# EAGLE design megacommand21 (EAGLE 7.3.0)

## Sheet 1 of 5
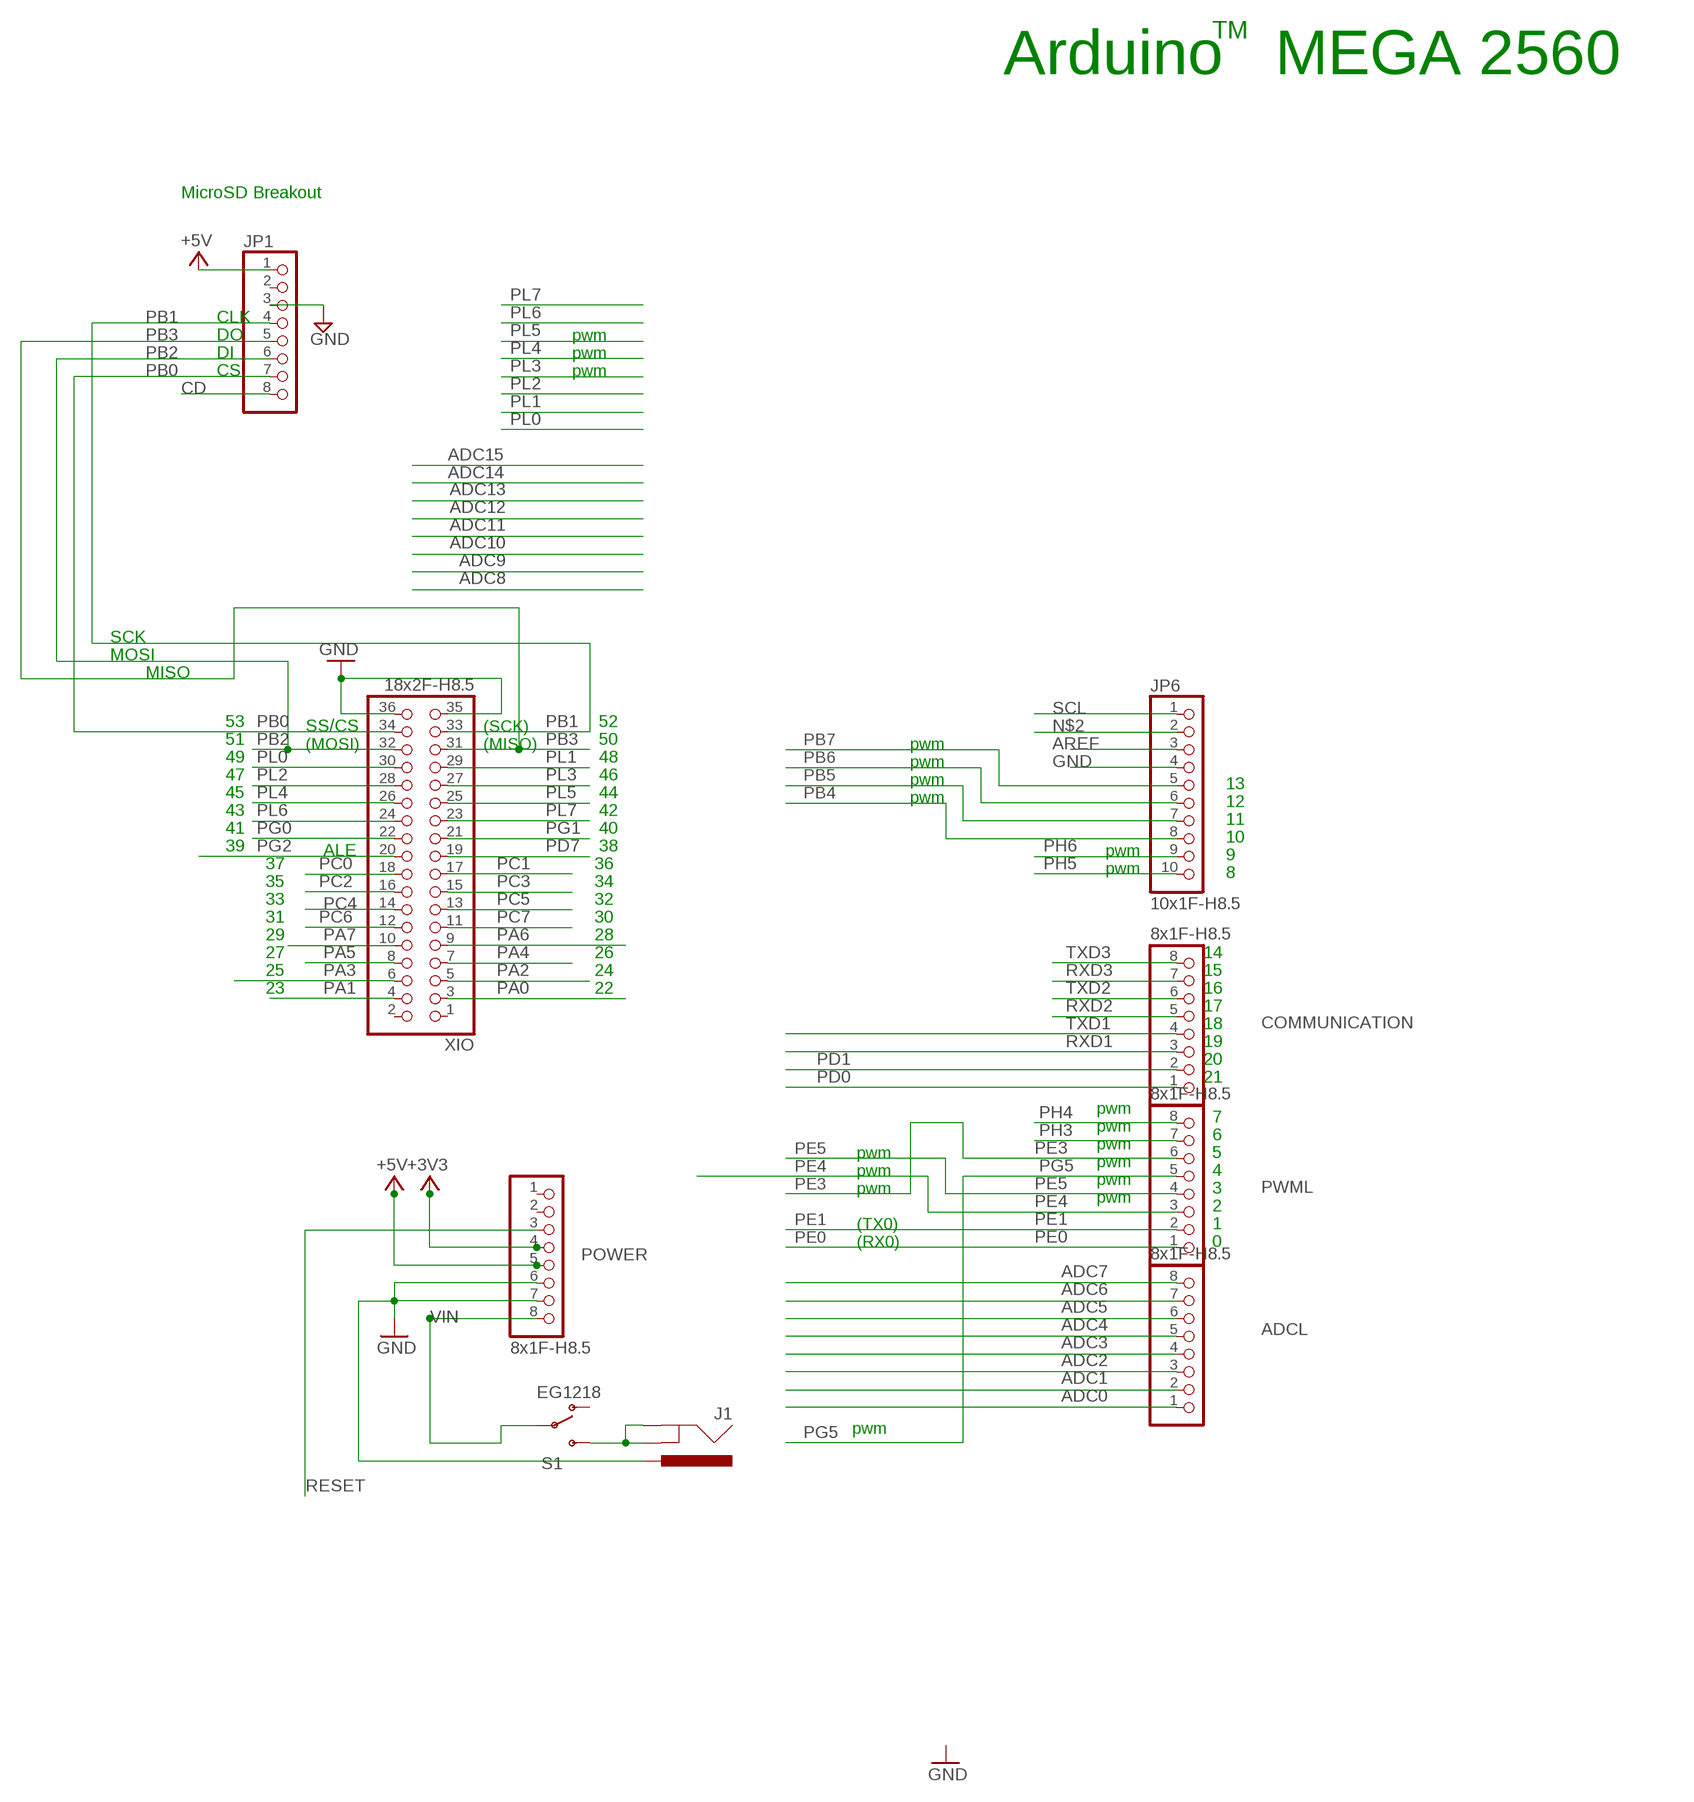
[diagram p0: schematic, sheet 1]

### Parts
ADCL  8x1F-H8.5  PINHD-1X8  [1X08]
COMMUNICATION  8x1F-H8.5  PINHD-1X8  [1X08]
J1  POWER_JACKSLT  [POWER_JACK_SLOT]
JP1  PINHD-1X8BIG  [1X08-BIG]
JP6  10x1F-H8.5  PINHD-1X10_ARD  [1X10]
POWER  8x1F-H8.5  PINHD-1X8  [1X08]
PWML  8x1F-H8.5  PINHD-1X8  [1X08]
S1  EG1218  SWITCH-SPDTKIT  [SWITCH-SPDT_KIT]
XIO  18x2F-H8.5  PINHD-2X18  [2X18]

### Nets
+3V3 [power]: POWER.4
+5V: JP1.1 POWER.5 ; also sheet 2,3,4,5
ADC0: ADCL.1 ; also sheet 3
ADC1: ADCL.2 ; also sheet 3
ADC2: ADCL.3 ; also sheet 3
ADC3: ADCL.4 ; also sheet 3
ADC4: ADCL.5
ADC5: ADCL.6
ADC6: ADCL.7
ADC7: ADCL.8
AREF: JP6.3
CD: JP1.8
GND: J1.PWR JP1.3 JP6.4 POWER.6 POWER.7 XIO.35 XIO.36 ; also sheet 2,3,4,5
N$2: JP6.2
N$23: J1.GND@1(GNDBREAK) J1.GND@2(GND) S1.3(S)
PA0: XIO.3 ; also sheet 4
PA1: XIO.4 ; also sheet 4
PA2: XIO.5 ; also sheet 4
PA3: XIO.6 ; also sheet 4
PA4: XIO.7 ; also sheet 4
PA5: XIO.8 ; also sheet 4
PA6: XIO.9 ; also sheet 4
PA7: XIO.10 ; also sheet 4
PB0: JP1.7 XIO.34
PB1: JP1.4 XIO.33
PB2: JP1.6 XIO.32
PB3: JP1.5 XIO.31
PB4: JP6.8
PB5: JP6.7
PB6: JP6.6
PB7: JP6.5
PC0: XIO.18 ; also sheet 4
PC1: XIO.17 ; also sheet 4
PC2: XIO.16 ; also sheet 4
PC3: XIO.15 ; also sheet 4
PC4: XIO.14 ; also sheet 4
PC5: XIO.13 ; also sheet 4
PC6: XIO.12 ; also sheet 4
PC7: XIO.11 ; also sheet 4
PD0: COMMUNICATION.1
PD1: COMMUNICATION.2
PD7: XIO.19
PE0: PWML.1
PE1: PWML.2
PE3: PWML.6
PE4: PWML.3 ; also sheet 3
PE5: PWML.4 ; also sheet 3
PG0: XIO.22 ; also sheet 4
PG1: XIO.21 ; also sheet 4
PG2: XIO.20 ; also sheet 4
PG5: PWML.5
PH3: PWML.7
PH4: PWML.8
PH5: JP6.10
PH6: JP6.9
PL0: XIO.30 ; also sheet 2
PL1: XIO.29 ; also sheet 2
PL2: XIO.28 ; also sheet 2
PL3: XIO.27 ; also sheet 3
PL4: XIO.26 ; also sheet 3
PL5: XIO.25
PL6: XIO.24 ; also sheet 4
PL7: XIO.23
RESET: POWER.3
RXD1: COMMUNICATION.3 ; also sheet 5
RXD2: COMMUNICATION.5 ; also sheet 5
RXD3: COMMUNICATION.7
SCL: JP6.1
TXD1: COMMUNICATION.4 ; also sheet 5
TXD2: COMMUNICATION.6 ; also sheet 5
TXD3: COMMUNICATION.8
VIN: POWER.8 S1.2(P)
Unconnected: JP1.2 POWER.1 POWER.2 S1.1(O) XIO.1 XIO.2

### Notes on the sheet
- TM
- Arduino   MEGA 2560
- MicroSD Breakout
- CLK
- DO | pwm
- DI | pwm
- CS | pwm
- SCK
- MOSI
- MISO
- 53 | SS/CS | (SCK) | 52
- 51 | (MOSI) | (MISO) | 50 | pwm
- 49 | 48 | pwm
- 47 | 46 | pwm
- 13
- 45 | 44 | pwm
- 12
- 43 | 42
- 11
- 41 | 40
- 10
- 39 | ALE | 38 | pwm
- 9
- 37 | 36 | pwm
- 8
- 35 | 34
- 33 | 32
- 31 | 30
- 29 | 28
- 27 | 26 | 14
- 25 | 24 | 15
- 23 | 22 | 16
- 17
- 18
- 19
- 20
- 21
- pwm
- 7
- pwm
- 6
- pwm
- pwm | 5
- pwm
- pwm | 4
- pwm
- pwm | 3
- pwm
- 2
- (TX0) | 1
- (RX0) | 0
- pwm

## Sheet 2 of 5
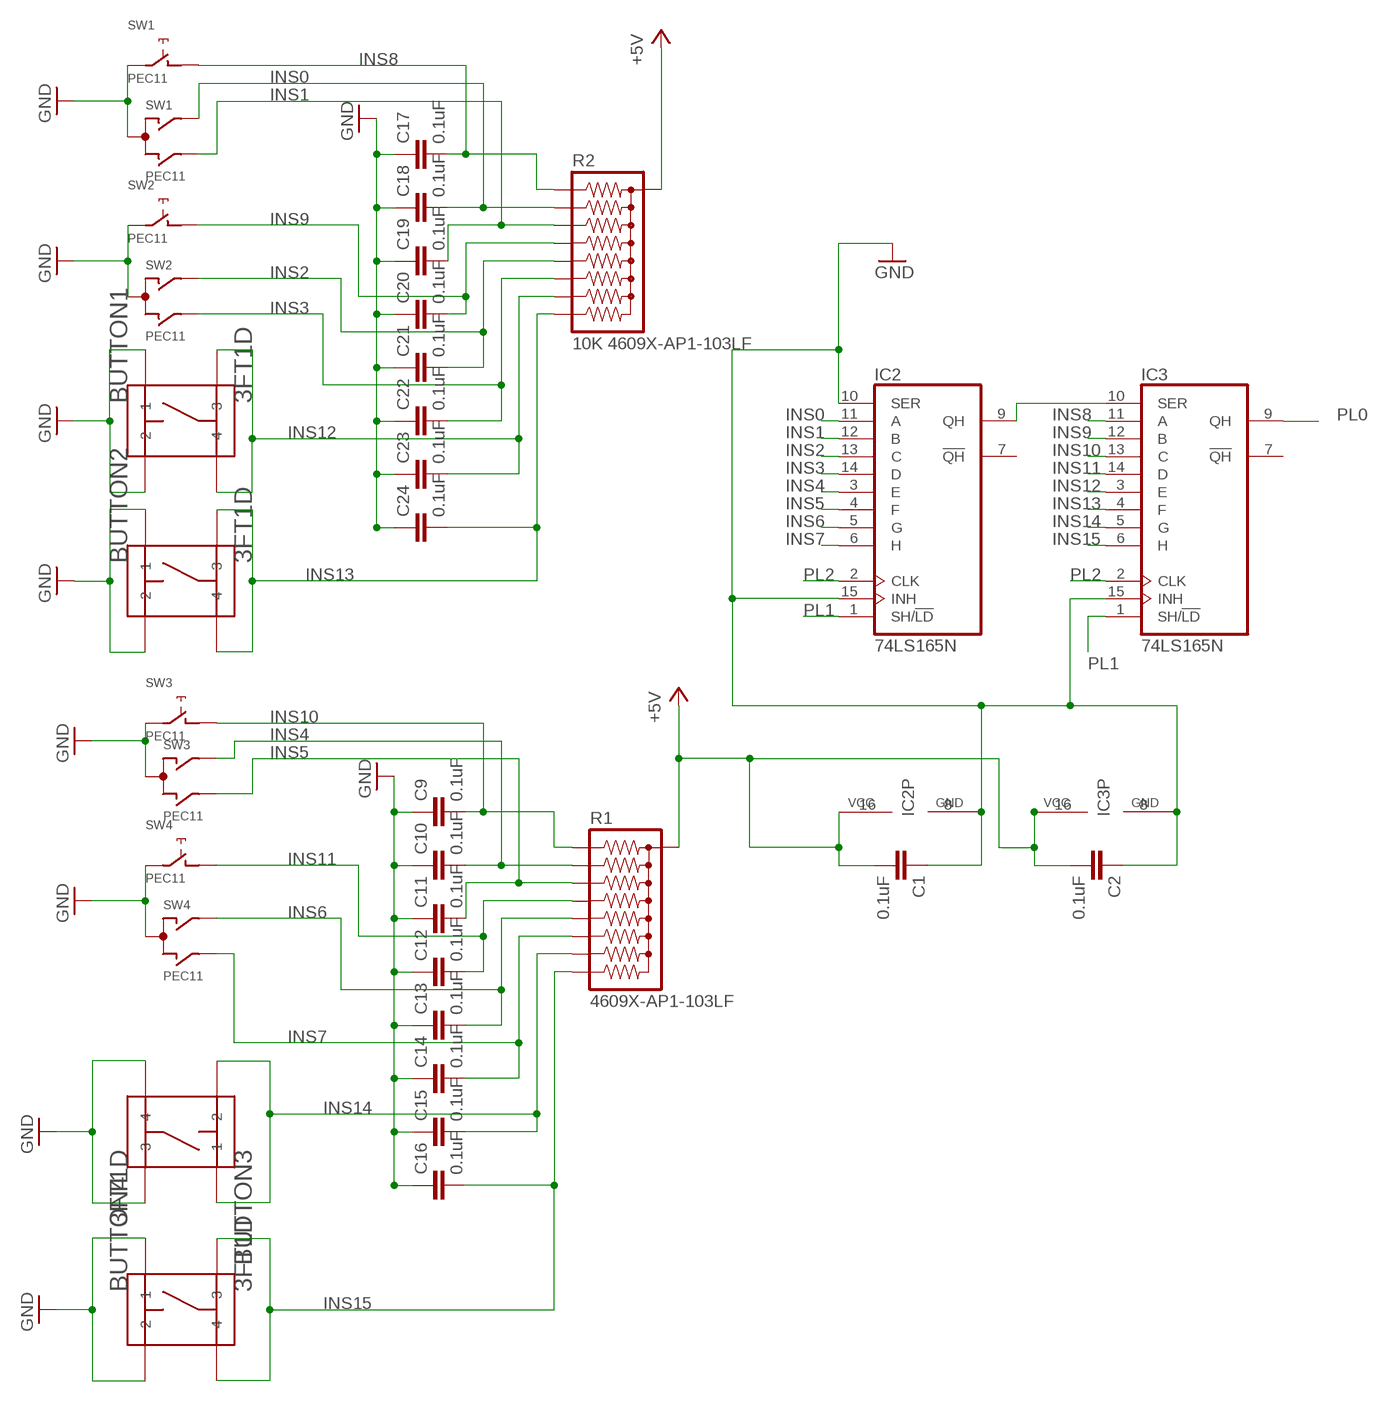
[diagram p1: schematic, sheet 2]

### Parts
BUTTON1  3FT1D  [3FT]
BUTTON2  3FT1D  [3FT]
BUTTON3  3FT1D  [3FT]
BUTTON4  3FT1D  [3FT]
C1  0.1uF  C-EU025-050X050  [C025-050X050]
C2  0.1uF  C-EU025-050X050  [C025-050X050]
C9  0.1uF  C-EU025-050X050  [C025-050X050]
C10  0.1uF  C-EU025-050X050  [C025-050X050]
C11  0.1uF  C-EU025-050X050  [C025-050X050]
C12  0.1uF  C-EU025-050X050  [C025-050X050]
C13  0.1uF  C-EU025-050X050  [C025-050X050]
C14  0.1uF  C-EU025-050X050  [C025-050X050]
C15  0.1uF  C-EU025-050X050  [C025-050X050]
C16  0.1uF  C-EU025-050X050  [C025-050X050]
C17  0.1uF  C-EU025-050X050  [C025-050X050]
C18  0.1uF  C-EU025-050X050  [C025-050X050]
C19  0.1uF  C-EU025-050X050  [C025-050X050]
C20  0.1uF  C-EU025-050X050  [C025-050X050]
C21  0.1uF  C-EU025-050X050  [C025-050X050]
C22  0.1uF  C-EU025-050X050  [C025-050X050]
C23  0.1uF  C-EU025-050X050  [C025-050X050]
C24  0.1uF  C-EU025-050X050  [C025-050X050]
IC2  74LS165N  [DIL16]
IC3  74LS165N  [DIL16]
R1  4609X-AP1-103LF  RPACK-BUSSED-8-SIP-PTH-8  [RPACK-SIP-PTH-8]
R2  10K 4609X-AP1-103LF  RPACK-BUSSED-8-SIP-PTH-8  [RPACK-SIP-PTH-8]
SW1  PEC11  EC12E_SW  [ALPS_EC12E_SW]
SW2  PEC11  EC12E_SW  [ALPS_EC12E_SW]
SW3  PEC11  EC12E_SW  [ALPS_EC12E_SW]
SW4  PEC11  EC12E_SW  [ALPS_EC12E_SW]

### Nets
+5V: C1.2 C2.2 IC2.16(VCC) IC3.16(VCC) R1.P$1 R2.P$1 ; also sheet 1,3,4,5
GND: BUTTON1.P$1 BUTTON1.P$2 BUTTON2.P$1 BUTTON2.P$2 BUTTON3.P$3 BUTTON3.P$4 BUTTON4.P$1 BUTTON4.P$2 C1.1 C2.1 C9.1 C10.1 C11.1 C12.1 C13.1 C14.1 C15.1 C16.1 C17.1 C18.1 C19.1 C20.1 C21.1 C22.1 C23.1 C24.1 IC2.8(GND) IC2.10(SER) IC2.15(INH) IC3.8(GND) IC3.15(INH) SW1.C SW1.E SW2.C SW2.E SW3.C SW3.E SW4.C SW4.E ; also sheet 1,3,4,5
INS0: C18.2 IC2.11(A) R2.P$3 SW1.A
INS1: C19.2 IC2.12(B) R2.P$4 SW1.B
INS2: C21.2 IC2.13(C) R2.P$6 SW2.A
INS3: C22.2 IC2.14(D) R2.P$7 SW2.B
INS4: C10.2 IC2.3(E) R1.P$3 SW3.A
INS5: C11.2 IC2.4(F) R1.P$4 SW3.B
INS6: C13.2 IC2.5(G) R1.P$6 SW4.A
INS7: C14.2 IC2.6(H) R1.P$7 SW4.B
INS8: C17.2 IC3.11(A) R2.P$2 SW1.D
INS9: C20.2 IC3.12(B) R2.P$5 SW2.D
INS10: C9.2 IC3.13(C) R1.P$2 SW3.D
INS11: C12.2 IC3.14(D) R1.P$5 SW4.D
INS12: BUTTON1.P$3 BUTTON1.P$4 C23.2 IC3.3(E) R2.P$8
INS13: BUTTON2.P$3 BUTTON2.P$4 C24.2 IC3.4(F) R2.P$9
INS14: BUTTON3.P$1 BUTTON3.P$2 C15.2 IC3.5(G) R1.P$8
INS15: BUTTON4.P$3 BUTTON4.P$4 C16.2 IC3.6(H) R1.P$9
N$12: IC2.9(QH) IC3.10(SER)
PL0: IC3.9(QH) ; also sheet 1
PL1: IC2.1(SH/!LD) IC3.1(SH/!LD) ; also sheet 1
PL2: IC2.2(CLK) IC3.2(CLK) ; also sheet 1
Unconnected: IC2.7(!QH) IC3.7(!QH) SW1.GND1(GND1:G) SW1.GND2(GND2:G) SW2.GND1(GND1:G) SW2.GND2(GND2:G) SW3.GND1(GND1:G) SW3.GND2(GND2:G) SW4.GND1(GND1:G) SW4.GND2(GND2:G)

## Sheet 3 of 5
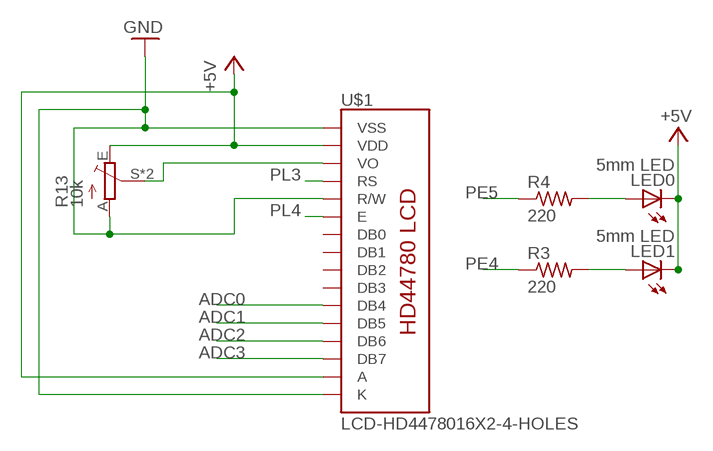
[diagram p2: schematic, sheet 3]

### Parts
LED0  5mm LED  LED_ELD260  [LED_LD260]
LED1  5mm LED  LED_ELD260  [LED_LD260]
R3  220  R-US_0207/7  [0207/7]
R4  220  R-US_0207/7  [0207/7]
R13  10k  TRIM_EU-CA6V  [CA6V]
U$1  LCD-HD4478016X2-4-HOLES  [LCD-16X2-4HOLESRGB]

### Nets
+5V: LED0.K(C) LED1.K(C) R13.E U$1.2(VDD) U$1.15(A) U$1.18(VDD) U$1.31(A) ; also sheet 1,2,4,5
ADC0: U$1.11(DB4) U$1.27(DB4) ; also sheet 1
ADC1: U$1.12(DB5) U$1.28(DB5) ; also sheet 1
ADC2: U$1.13(DB6) U$1.29(DB6) ; also sheet 1
ADC3: U$1.14(DB7) U$1.30(DB7) ; also sheet 1
GND: R13.A U$1.1(VSS) U$1.5(R/W) U$1.16(K) U$1.17(VSS) U$1.21(R/W) U$1.32(K) ; also sheet 1,2,4,5
N$3: LED0.A R4.2
N$13: LED1.A R3.2
N$27: R13.S R13.S1(S) U$1.3(VO) U$1.19(VO)
PE4: R3.1 ; also sheet 1
PE5: R4.1 ; also sheet 1
PL3: U$1.4(RS) U$1.20(RS) ; also sheet 1
PL4: U$1.6(E) U$1.22(E) ; also sheet 1
Unconnected: U$1.7(DB0) U$1.8(DB1) U$1.9(DB2) U$1.10(DB3) U$1.23(DB0) U$1.24(DB1) U$1.25(DB2) U$1.26(DB3)

## Sheet 4 of 5
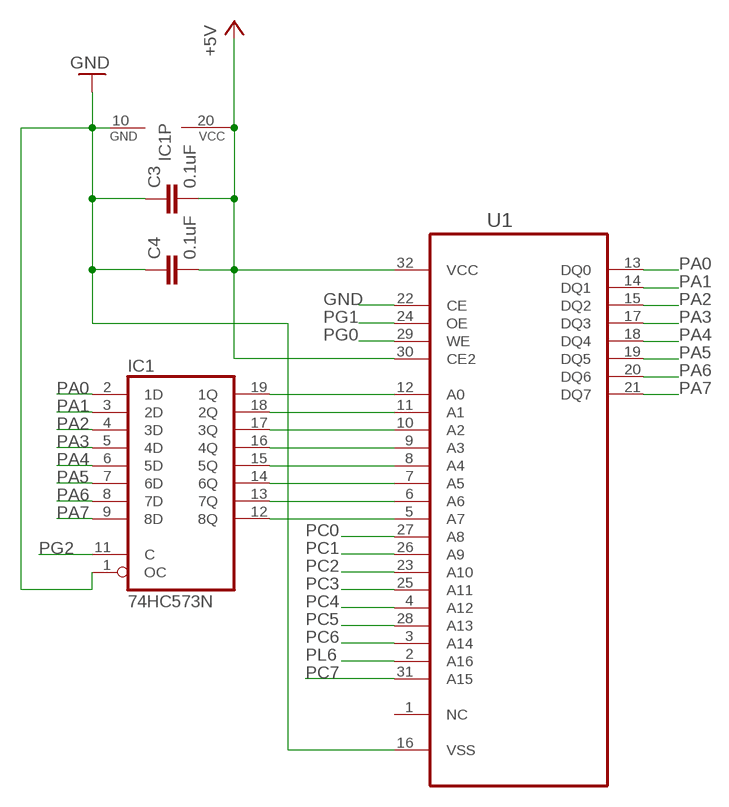
[diagram p3: schematic, sheet 4]

### Parts
C3  0.1uF  C-EU025-050X050  [C025-050X050]
C4  0.1uF  C-EU025-050X050  [C025-050X050]
IC1  74HC573N  [DIL20]
U1  AS6C1008-55PCN  [DIP254P1524X393-32]

### Nets
+5V: C3.2 C4.2 IC1.20(VCC) U1.30(CE2) U1.32(VCC) ; also sheet 1,2,3,5
GND: C3.1 C4.1 IC1.1(OC) IC1.10(GND) U1.16(VSS) U1.22(CE) ; also sheet 1,2,3,5
N$4: IC1.13(7Q) U1.6(A6)
N$5: IC1.19(1Q) U1.12(A0)
N$6: IC1.18(2Q) U1.11(A1)
N$7: IC1.17(3Q) U1.10(A2)
N$8: IC1.16(4Q) U1.9(A3)
N$9: IC1.15(5Q) U1.8(A4)
N$10: IC1.14(6Q) U1.7(A5)
N$11: IC1.12(8Q) U1.5(A7)
PA0: IC1.2(1D) U1.13(DQ0) ; also sheet 1
PA1: IC1.3(2D) U1.14(DQ1) ; also sheet 1
PA2: IC1.4(3D) U1.15(DQ2) ; also sheet 1
PA3: IC1.5(4D) U1.17(DQ3) ; also sheet 1
PA4: IC1.6(5D) U1.18(DQ4) ; also sheet 1
PA5: IC1.7(6D) U1.19(DQ5) ; also sheet 1
PA6: IC1.8(7D) U1.20(DQ6) ; also sheet 1
PA7: IC1.9(8D) U1.21(DQ7) ; also sheet 1
PC0: U1.27(A8) ; also sheet 1
PC1: U1.26(A9) ; also sheet 1
PC2: U1.23(A10) ; also sheet 1
PC3: U1.25(A11) ; also sheet 1
PC4: U1.4(A12) ; also sheet 1
PC5: U1.28(A13) ; also sheet 1
PC6: U1.3(A14) ; also sheet 1
PC7: U1.31(A15) ; also sheet 1
PG0: U1.29(WE) ; also sheet 1
PG1: U1.24(OE) ; also sheet 1
PG2: IC1.11(C) ; also sheet 1
PL6: U1.2(A16) ; also sheet 1
Unconnected: U1.1(NC)

## Sheet 5 of 5
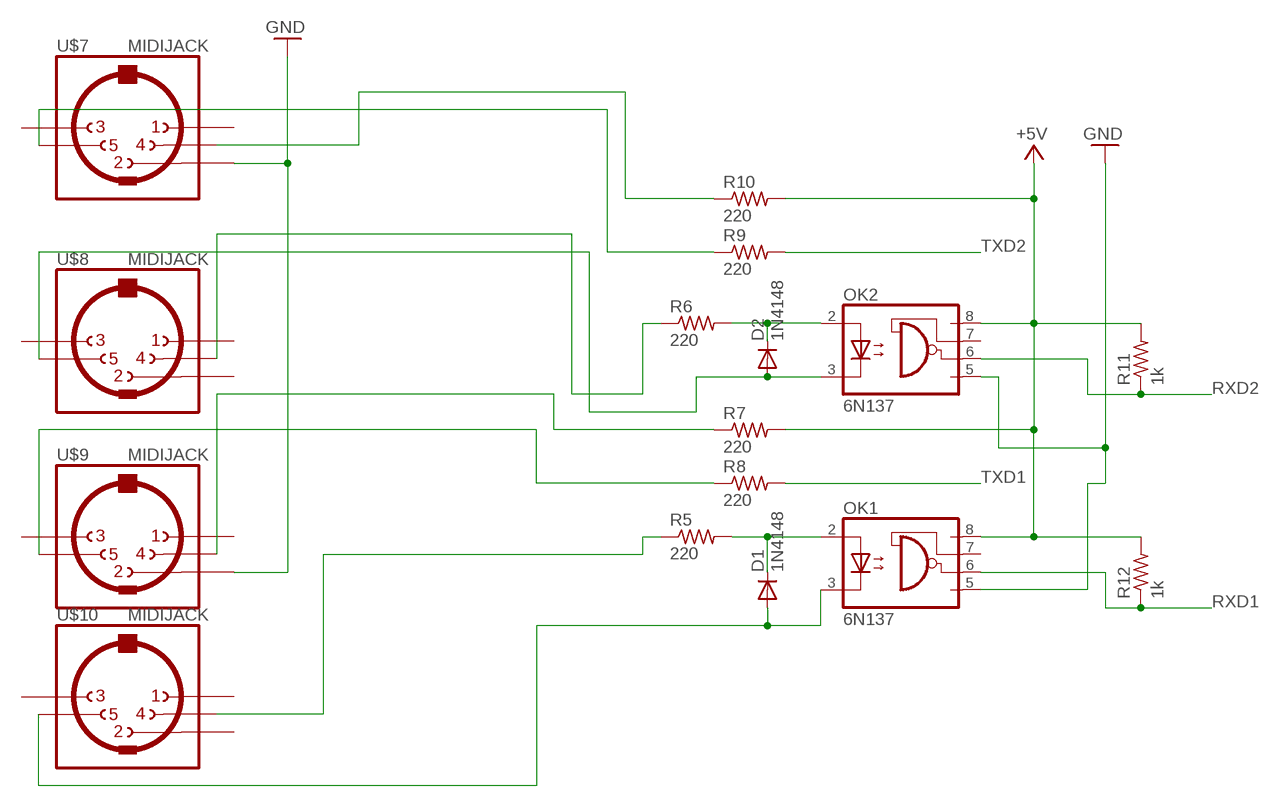
[diagram p4: schematic, sheet 5]

### Parts
D1  1N4148  1N4148DO35-7  [DO35-7]
D2  1N4148  1N4148DO35-7  [DO35-7]
OK1  6N137  [DIL08]
OK2  6N137  [DIL08]
R5  220  R-US_0207/7  [0207/7]
R6  220  R-US_0207/7  [0207/7]
R7  220  R-US_0207/7  [0207/7]
R8  220  R-US_0207/7  [0207/7]
R9  220  R-US_0207/7  [0207/7]
R10  220  R-US_0207/7  [0207/7]
R11  1k  R-US_0207/7  [0207/7]
R12  1k  R-US_0207/7  [0207/7]
U$7  MIDIJACK  [CP-2350]
U$8  MIDIJACK  [CP-2350]
U$9  MIDIJACK  [CP-2350]
U$10  MIDIJACK  [CP-2350]

### Nets
+5V: OK1.8(VCC) OK2.8(VCC) R7.2 R10.2 R11.2 R12.2 ; also sheet 1,2,3,4
GND: OK1.5(GND) OK2.5(GND) U$7.2 U$9.2 ; also sheet 1,2,3,4
N$1: R8.1 U$9.5
N$14: D1.A OK1.3(C) U$10.5
N$15: R5.1 U$10.4
N$16: R7.1 U$9.4
N$17: R10.1 U$7.4
N$18: D2.C OK2.2(A) R6.2
N$19: D2.A OK2.3(C) U$8.5
N$21: R6.1 U$8.4
N$22: R9.1 U$7.5
N$26: D1.C OK1.2(A) R5.2
RXD1: OK1.6(VO) R12.1 ; also sheet 1
RXD2: OK2.6(VO) R11.1 ; also sheet 1
TXD1: R8.2 ; also sheet 1
TXD2: R9.2 ; also sheet 1
Unconnected: OK1.7(VE) OK2.7(VE) U$7.1 U$7.3 U$8.1 U$8.2 U$8.3 U$9.1 U$9.3 U$10.1 U$10.2 U$10.3

## Library data of the parts
ADCL COMMUNICATION POWER PWML = SmartPrj:PINHD-1X8: PIN HEADER
BUTTON1-BUTTON4 = mec switches:3FT1D: Mulitmec - 3FT1D <http://www.mec.dk/statisk.php4?id=504> Switch 3F - Through Hole with basic matt cover http://www.mec.dk
C1-C4 C9-C24 = rcl:C-EU: CAPACITOR, European symbol
D1 D2 = diode:1N4148: DIODE high speed (Philips)
IC1 = 74xx-us:74*573: 8-bit D latch BUS DRIVER
IC2 IC3 = 74xx-us:74*165: 8-bit parallel load SHIFT REGISTER
J1 = SparkFun-Connectors:POWER_JACK: Power Jack This is the standard 5.5mm barrel jack for power. The PTH is the most common, proven, reliable, footprint. The Slot footprint only works if the mill layer is transmitted to the PCB fab house so be warned. Mating wall wart : TOL-00298 (and others); PROD_ID: PRT-00119
JP1 = adafruit:PINHD-1X8: PIN HEADER
JP6 = SmartPrj:PINHD-1X10_ARD: PIN HEADER
LED0 LED1 = eagle-ltspice:LED_E: LED Source: http://www.osram.convergy.de Source: www.luxeon.com Source: www.kingbright.com; SPICEMODEL: NONE; SPICEPREFIX: D; SPICETYPE: diode
OK1 OK2 = optocoupler:6N137: MOTOROLA OPTO COUPLER; MPN: 6N137; OC_FARNELL: 1328376; OC_NEWARK: 52M1895
R1 R2 = SparkFun-Resistors:RPACK-BUSSED-8: BOURNS 4600X/R series thick-film SIP resistor packs Height resistors bussed to a single pin (denoted by dot). datasheet <http://dlnmh9ip6v2uc.cloudfront.net/datasheets/Components/General/4600x.pdf> SIMILAR TO: SFE parts COM-10855 (330), COM-10856 (10K)
R3-R12 = resistor:R-US_: RESISTOR, American symbol
R13 = pot:TRIM_EU-: POTENTIOMETER
S1 = SparkFun-Electromechanical:SWITCH-SPDT: SPDT Switch Simple slide switch, Spark Fun Electronics SKU : COM-00102 DPDT SMT slide switch, AYZ0202, SWCH-08179; PROD_ID: SWCH-08261
SW1-SW4 = pec11-n:EC12E_SW: ALPS rotary Encoder EC12E series with switch; MPN: EC12E2424407; OC_FARNELL: 1520813; OC_NEWARK: 74M1068
U1 = Alliance_Memory_By_element14_Batch_1:AS6C1008-55PCN: CMOS SRAM; MPN: AS6C1008-55PCN; OC_FARNELL: 1562896; OC_NEWARK: 94M6214; PACKAGE: DIP-32; SUPPLIER: ALLIANCE MEMORY
U$1 = HD44780LCD:LCD-HD44780
U$7-U$10 = adafruit_din:MIDIJACK: DIN 5 jack also known as MIDI jack A modification of conn-hirshman:MAB5SH with two options for the grounding 'teeth'
XIO = SmartPrj:PINHD-2X18: PIN HEADER

## Net classes
0 default: width 0.203 mm, drill 0.406 mm, clearance 0.203 mm
1 power: width 0.61 mm, drill 0.406 mm, clearance 0.203 mm
2 gnd: width 0.305 mm, drill 0.406 mm, clearance 0.203 mm
3 power usb: width 0.508 mm, drill 0.406 mm, clearance 0.203 mm

## Board
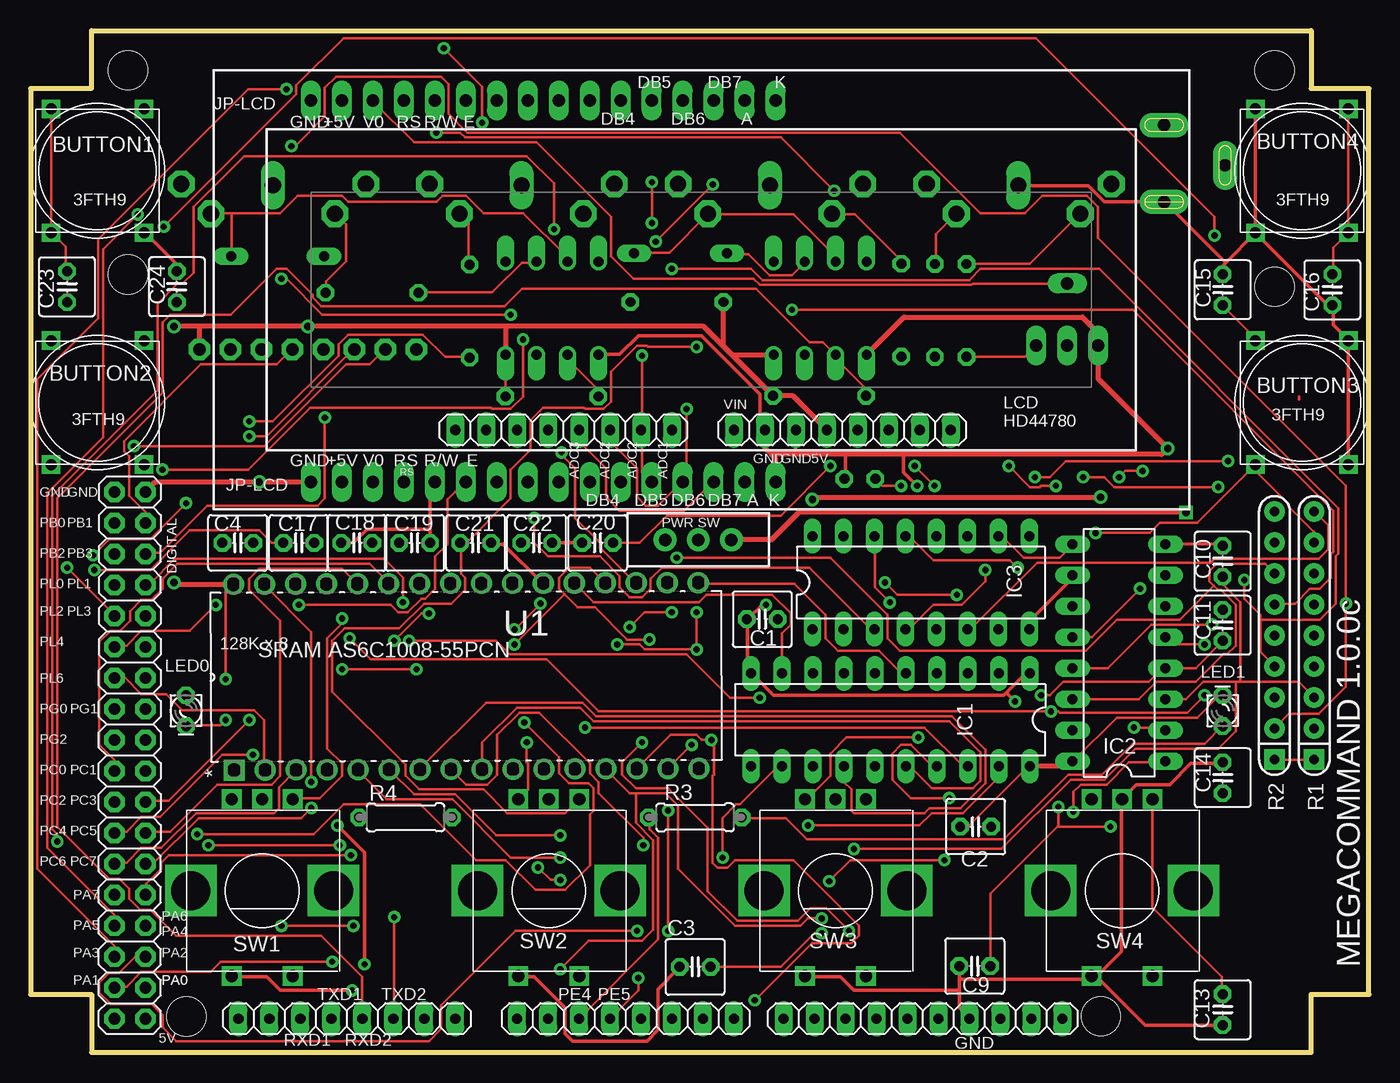
[diagram p5: board, top side]
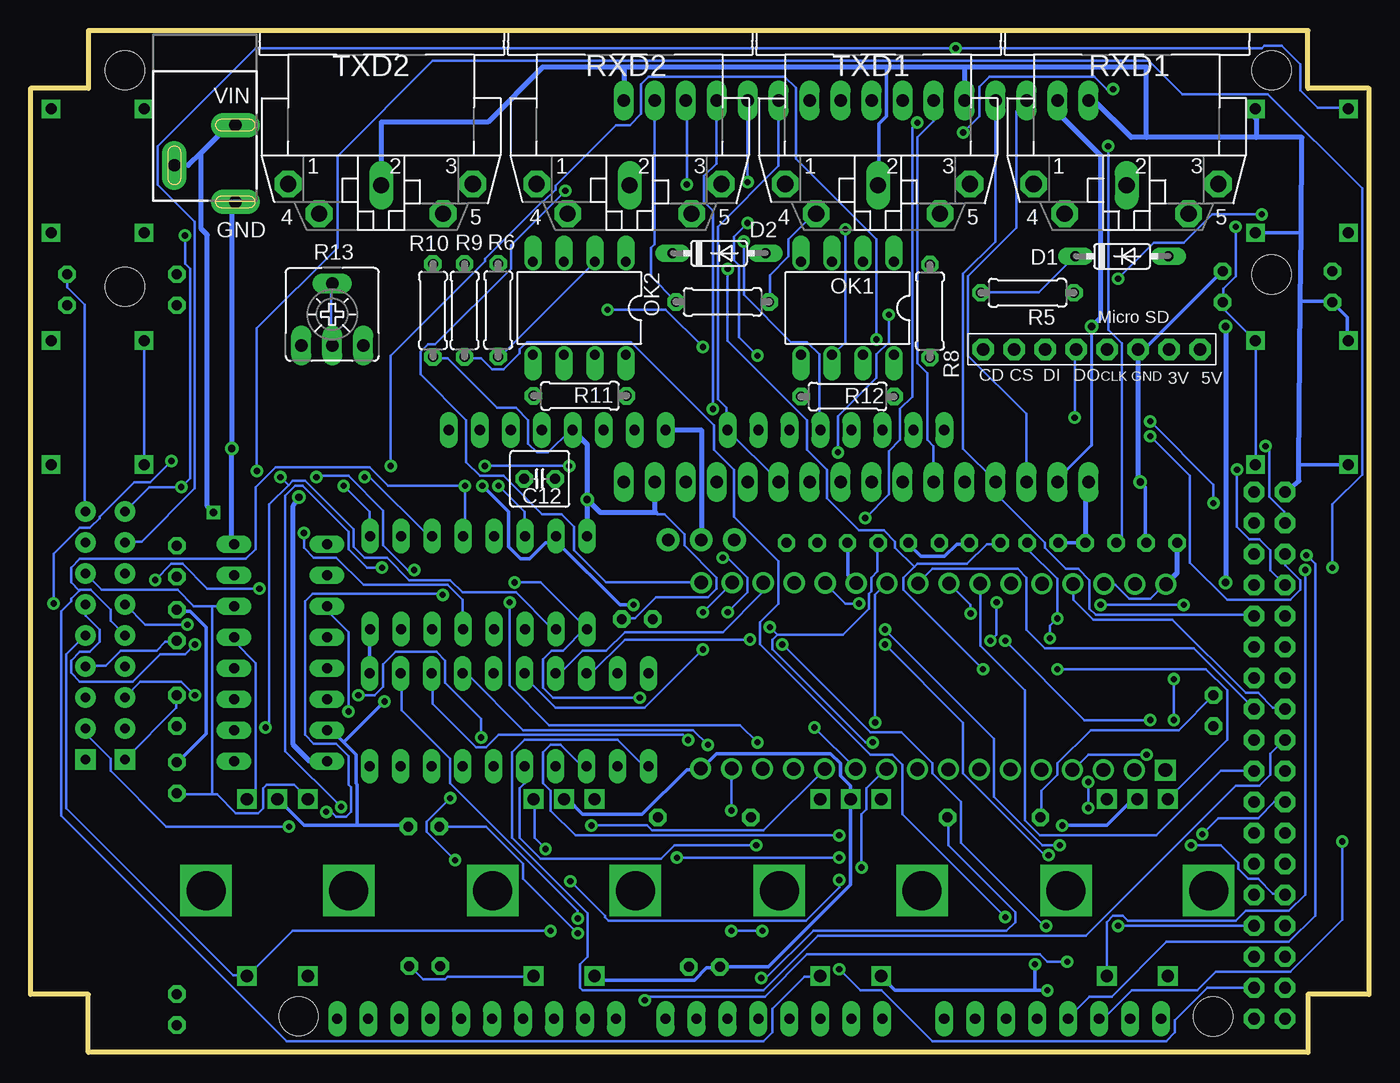
[diagram p6: board, bottom side, seen from below]

Size 109.75 x 83.75 mm. Coordinates in mm from the lower left corner, seen from the top.
Outline: 0,79 0,4.75 5,4.75 5,0 105,0 105,4.75 109.75,4.75 109.75,79 105,79 105,83.75 5,83.75 5,79 0,79
Copper layers (1*16): Top 0.035mm / dielectric 1.5mm / Bottom 0.035mm
Design rules "SparkFun": minimum track width 8mil, minimum drill 20mil, track to track 8mil, track to pad 8mil, pad to pad 8mil, via to via 8mil, smd to smd 8mil, copper to edge 10mil, drill to drill 8mil, minimum pad ring 12mil, minimum via ring 10mil, stop-mask expansion 4mil, vias tented up to drill 25mil, thermal gap 10mil
Holes 3.2 mm at 87.77,2.95 12.79,2.92 8,63.75 102,62.75 8,80.5 102,80.5

### Footprints (pad centres in the part's own frame; a part is rotated, then mirrored left to right if it is on the bottom)
1X08 = drill 0.85 pad 1.422 long: 1 -8.89,0; 2 -6.35,0; 3 -3.81,0; 4 -1.27,0; 5 1.27,0; 6 3.81,0; 7 6.35,0; 8 8.89,0
3FT = drill 0.9 square: P$1 5.08,3.81; P$2 -5.08,3.81; P$3 5.08,-3.81; P$4 -5.08,-3.81
C025-050X050 = drill 0.813 octagon: 1 -1.27,0; 2 1.27,0
DO35-7 = drill 0.813 long: A 3.81,0; C -3.81,0
DIL20 = drill 0.813 long: 1 -11.43,-3.81; 2 -8.89,-3.81; 3 -6.35,-3.81; 4 -3.81,-3.81; 5 -1.27,-3.81; 6 1.27,-3.81; 7 3.81,-3.81; 8 6.35,-3.81; 9 8.89,-3.81; 10 11.43,-3.81; 11 11.43,3.81; 12 8.89,3.81; 13 6.35,3.81; 14 3.81,3.81; 15 1.27,3.81; 16 -1.27,3.81; 17 -3.81,3.81; 18 -6.35,3.81; 19 -8.89,3.81; 20 -11.43,3.81
DIL16 = drill 0.813 long: 1 -8.89,-3.81; 2 -6.35,-3.81; 3 -3.81,-3.81; 4 -1.27,-3.81; 5 1.27,-3.81; 6 3.81,-3.81; 7 6.35,-3.81; 8 8.89,-3.81; 9 8.89,3.81; 10 6.35,3.81; 11 3.81,3.81; 12 1.27,3.81; 13 -1.27,3.81; 14 -3.81,3.81; 15 -6.35,3.81; 16 -8.89,3.81
POWER_JACK_SLOT = drill 1 pad 2 long: GND@1 2.58,7.5; GND@2 7.58,10.8; PWR 2.58,13.8
1X08-BIG = drill 1.016 pad 1.778 octagon: 1 -8.89,0; 2 -6.35,0; 3 -3.81,0; 4 -1.27,0; 5 1.27,0; 6 3.81,0; 7 6.35,0; 8 8.89,0
1X10 = drill 0.85 pad 1.422 long: 1 -11.43,0; 2 -8.89,0; 3 -6.35,0; 4 -3.81,0; 5 -1.27,0; 6 1.27,0; 7 3.81,0; 8 6.35,0; 9 8.89,0; 10 11.43,0
LED_LD260 = drill 0.813 octagon: A -1.27,0; K 1.27,0
DIL08 = drill 0.813 offset: 1 -3.81,-3.81; 2 -1.27,-3.81; 3 1.27,-3.81; 4 3.81,-3.81; 5 3.81,3.81; 6 1.27,3.81; 7 -1.27,3.81; 8 -3.81,3.81
RPACK-SIP-PTH-8 = drill 0.8 pad 1.676 square: P$1 0,0 | drill 0.8 pad 1.676: P$2 0,-2.54; P$3 0,-5.08; P$4 0,-7.62; P$5 0,-10.16; P$6 0,-12.7; P$7 0,-15.24; P$8 0,-17.78; P$9 0,-20.32
0207/7 = drill 0.813 octagon: 1 -3.81,0; 2 3.81,0
CA6V = drill 1.016 long: A -2.54,-2.54; E 2.54,-2.54; S 0,2.54; S1 0,-2.54
SWITCH-SPDT_KIT = drill 1.016 pad 1.88: 1 0,2.718; 2 0,0; 3 0,-2.718
ALPS_EC12E_SW = drill 1 square: A -2.5,-7.5; B 2.5,-7.5; C 0,-7.5; D -2.5,7; E 2.5,7 | drill 3.2 square: GND1 -5.85,0; GND2 5.85,0
DIP254P1524X393-32 = drill 1.118 square: 1 -15.24,38.1 | drill 1.118: 2 -15.24,35.56; 3 -15.24,33.02; 4 -15.24,30.48; 5 -15.24,27.94; 6 -15.24,25.4; 7 -15.24,22.86; 8 -15.24,20.32; 9 -15.24,17.78; 10 -15.24,15.24; 11 -15.24,12.7; 12 -15.24,10.16; 13 -15.24,7.62; 14 -15.24,5.08; 15 -15.24,2.54; 16 -15.24,0; 17 0,0; 18 0,2.54; 19 0,5.08; 20 0,7.62; 21 0,10.16; 22 0,12.7; 23 0,15.24; 24 0,17.78; 25 0,20.32; 26 0,22.86; 27 0,25.4; 28 0,27.94; 29 0,30.48; 30 0,33.02; 31 0,35.56; 32 0,38.1
LCD-16X2-4HOLESRGB = drill 1.016 long: 1 -32,15.5; 2 -29.46,15.5; 3 -26.92,15.5; 4 -24.38,15.5; 5 -21.84,15.5; 6 -19.3,15.5; 7 -16.76,15.5; 8 -14.22,15.5; 9 -11.68,15.5; 10 -9.14,15.5; 11 -6.6,15.5; 12 -4.06,15.5; 13 -1.52,15.5; 14 1.02,15.5; 15 3.56,15.5; 16 6.1,15.5; 17 -32,-15.75; 18 -29.46,-15.75; 19 -26.92,-15.75; 20 -24.38,-15.75; 21 -21.84,-15.75; 22 -19.3,-15.75; 23 -16.76,-15.75; 24 -14.22,-15.75; 25 -11.68,-15.75; 26 -9.14,-15.75; 27 -6.6,-15.75; 28 -4.06,-15.75; 29 -1.52,-15.75; 30 1.02,-15.75; 31 3.56,-15.75; 32 6.1,-15.75
CP-2350 = drill 1.321 pad 2.184 octagon: 1 7.62,12.58; 3 -7.52,12.58; 4 5.08,15.02; 5 -5.08,15.02 | drill 1.321 long: 2 0,12.68
2X18 = drill 0.95 pad 1.676 octagon: 1 -21.59,-1.27; 2 -21.59,1.27; 3 -19.05,-1.27; 4 -19.05,1.27; 5 -16.51,-1.27; 6 -16.51,1.27; 7 -13.97,-1.27; 8 -13.97,1.27; 9 -11.43,-1.27; 10 -11.43,1.27; 11 -8.89,-1.27; 12 -8.89,1.27; 13 -6.35,-1.27; 14 -6.35,1.27; 15 -3.81,-1.27; 16 -3.81,1.27; 17 -1.27,-1.27; 18 -1.27,1.27; 19 1.27,-1.27; 20 1.27,1.27; 21 3.81,-1.27; 22 3.81,1.27; 23 6.35,-1.27; 24 6.35,1.27; 25 8.89,-1.27; 26 8.89,1.27; 27 11.43,-1.27; 28 11.43,1.27; 29 13.97,-1.27; 30 13.97,1.27; 31 16.51,-1.27; 32 16.51,1.27; 33 19.05,-1.27; 34 19.05,1.27; 35 21.59,-1.27; 36 21.59,1.27

### Placement (x,y rotation side)
ADCL  43.71,51.01 180 top
BUTTON1  5.5,72.25 270 top
BUTTON2  5.5,53.25 90 top
BUTTON3  104.25,53.25 90 top
BUTTON4  104.25,72.25 90 top
C1  60,35.5 0 top
C2  77.5,18.5 180 top
C3  54.5,7 0 top
C4  17,41.75 180 top
C9  77.42,7.07 0 top
C10  97.75,40.25 270 top
C11  97.75,35 270 top
C12  68,47 180 bottom
C13  97.75,3.5 90 top
C14  97.75,22.5 270 top
C15  97.75,62.5 270 top
C16  106.75,62.5 90 top
C17  22,41.75 180 top
C18  26.75,41.75 0 top
C19  31.5,41.75 180 top
C20  46.5,41.75 0 top
C21  36.5,41.75 180 top
C22  41.5,41.75 180 top
C23  3,62.75 90 top
C24  12,62.75 270 top
COMMUNICATION  25.93,2.75 0 top
D1  20.25,65.25 0 bottom
D2  53.29,65.5 0 bottom
IC1  70.5,27.25 180 top
IC2  89.25,32.75 90 top
IC3  73,38.5 0 top
J1  90.38,83.5 180 bottom
JP1  22.74,57.61 180 bottom
JP6  73.17,2.75 180 top
LED0  12.75,28 270 top
LED1  97.75,28 90 top
OK1  42.75,61 180 bottom
OK2  64.75,61 180 bottom
POWER  66.57,51.01 180 top
PWML  48.79,2.75 0 top
R1  105.25,24 180 top
R2  102,24 180 top
R3  54.5,19.25 0 top
R4  30.75,19.25 180 top
R5  28,62.25 180 bottom
R6  71.4,60.83 270 bottom
R7  53,61.5 180 bottom
R8  36,60.75 270 bottom
R9  74.16,60.8 270 bottom
R10  76.75,60.8 270 bottom
R11  64.7,53.8 0 bottom
R12  42.75,53.75 0 bottom
R13  85.01,60.48 0 bottom
S1  54.75,42 90 top
SW1  19,13.25 180 top
SW2  42.5,13.25 180 top
SW3  66,13.25 180 top
SW4  89.5,13.25 180 top
U1  54.75,38.5 90.2 top
U$1  55,62.5 0 top
U$7  81,83.75 180 bottom
U$8  60.62,83.75 180 bottom
U$9  40.25,83.75 180 bottom
U$10  19.88,83.75 180 bottom
XIO  8.15,24.34 90 top

### Tracks (layer width: path | path; a pad name or v marks a point on that pad's centre or on a via)
+5V  (via drill 0.51, 0.6)
  Top 0.203: v64.88,9.75 64.27,9.75 61.52,7.01 55.83,7.01 C3.2 | R1.P$1 105.21,23.98 102.06,23.98 R2.P$1 | R10.2 76.76,57 81.54,57 82.45,57.91 R13.E | v16.01,27.23 15.6,26.82 12.76,26.82 LED0.K | v16.01,30.58 16.01,38.2 U1.32 | R12.2 38.97,53.85 38.97,57 OK1.8 | LED1.K 97.69,29.26 97.49,29.26 95.66,27.43 89.06,27.43 85.6,23.98 IC2.16 | C2.2 76.25,18.59 76.97,18.59 81.74,23.37 IC1.20
  Top 0.406: POWER.5 62.51,53.8 R11.2 57.5,57.19 | 56.81,57.88 R7.2 | 56.81,57.88 57.5,57.19 | 57.5,57.19 OK2.8 | 56.81,57.88 55.19,59.5 39,59.5 | 39,59.5 v22.75,59.5 14,59.5 | 14,59.5 13.85,59.35 JP1.1 | OK1.8 39,57.25 39,59.5 | 14,59.5 v11.75,59.5 | v11.75,38.5 11.88,38.37 U1.32 | v64.11,45.32 64.29,45.5 v87.75,45.5 | IC2.16 85.02,23.44 IC1.20
  Bottom 0.203: v64.88,9.75 69.35,14.22 69.35,15.44 72.39,18.49 76.15,18.49 C2.2 | LED1.K 97.79,29.26 97.79,28.25 101.96,24.08 R2.P$1 | v16.01,30.58 v16.01,27.23 | C1.2 61.22,35.56 60.2,35.56 58.48,37.29 54.21,37.29 53.5,38 53.5,38.91 56.14,41.55 56.14,42.47 57.76,44.09 58.37,44.09 58.5,44.25 | U$1.15 58.58,77.93 58.58,66.24 58.88,65.94 58.88,63.6 56.85,61.57 R7.2 | U1.30 21.7,38.3 20.78,38.3 19.66,37.19 17.94,37.19 16.82,38.3 U1.32 | R10.2 76.66,56.9 75.54,56.9 71.48,52.83 69.96,52.83 68.94,51.82 68.94,49.89 68.23,49.17 67.31,49.17 65.48,51 POWER.5
  Bottom 0.254: U$1.18 25.54,46.96 22.75,49.75 v22.75,59.5
  Bottom 0.406: v11.75,59.5 v11.75,38.5 | U1.32 15.73,39.29 C4.2 | POWER.5 64.11,49.82 v64.11,45.32 | v64.11,45.32 IC3.16 | v87.75,45.5 88.25,44.75 88.25,25.25 86.86,23.86 IC2.16 | v64.11,45.32 63.04,44.25 58.5,44.25 58.56,44.31 U$1.31 | v22.75,59.5 22,60.25 22,73.5 25.54,77.04 U$1.2
ADC0
  Bottom 0.203: U$1.27 48.42,46.84 52.58,51 ADCL.1 52.68,51.1 52.68,52.83 53.4,53.54 53.4,67.67 48.42,72.64 48.42,77.93 U$1.11
ADC1  (via drill 0.51)
  Top 0.203: U$1.28 50.85,46.84 50.14,47.55 50.14,51 ADCL.2 50.14,51.1 v50.14,57.1 | v50.96,67.97 v50.96,71.32
  Bottom 0.203: v50.96,71.32 50.96,77.93 U$1.12 | v50.96,67.97 52.07,66.85 52.07,64.92 51.67,64.52 51.67,58.62 v50.14,57.1
ADC2  (via drill 0.51)
  Top 0.203: ADCL.3 47.6,51 47.6,49.99 49.74,47.85 49.74,45.52 50.45,44.81 51.46,44.81 53.4,46.74 U$1.29 53.5,46.84 53.8,47.14 v53.8,52.73
  Bottom 0.203: v53.8,52.73 53.8,68.99 54.51,69.7 54.51,71.83 53.5,72.85 53.5,77.93 U$1.13
ADC3  (via drill 0.51)
  Top 0.203: ADCL.4 45.06,51 45.06,49.99 47.2,47.85 47.2,45.52 48.31,44.4 53.6,44.4 55.94,46.74 U$1.30 | v51.26,66.45 v55.94,71.12
  Bottom 0.203: v55.94,71.12 55.94,77.93 U$1.14 | v51.26,66.45 51.26,62.08 47.4,58.22 46.08,58.22 45.06,57.2 45.06,51.1 ADCL.4
GND  (via drill 0.51, 0.6)
  Top 0.254: C10.1 97.63,41.64 IC2.8
  Top 0.305: v26.37,5.08 20.48,5.08 19.36,6.2 16.51,6.2 SW1.E | v25.15,18.59 27.39,16.36 v27.39,7.21 | IC2.10 85.4,39.01 85.4,38.81 81.94,35.36 81.94,34.75 IC3.8 | v60.3,36.68 60,36.68 58.88,35.56 C1.1 58.78,35.46 58.78,31.29 58.98,31.09 IC1.10 59.19,30.99 60.91,29.26 79.81,29.26 80.01,29.46 | 80.01,29.46 81.54,30.99 81.84,30.99 IC1.1 | C14.1 97.69,23.67 95.15,23.67 93.42,21.95 90.68,21.95 89.56,20.83 SW4.C 89.46,20.62 89.46,8.23 87.53,6.3 SW4.E | 76.15,5.08 76.15,3.66 76.97,2.85 JP6.4 | 76.15,5.08 76.15,5.99 | 76.15,5.99 76.15,7.01 C9.1 | C13.1 97.69,2.23 91.39,2.23 87.43,6.2 87.02,6.2 SW4.E | 76.15,5.99 86.82,5.99 86.92,6.1 SW4.E | 76.15,5.08 67.52,5.08 66.4,6.2 63.55,6.2 SW3.E | v80.72,28.75 80.01,29.46 | SW2.E 40.09,6.2 41.3,6.2 43.84,3.66 43.84,1.52 44.45,0.91 50.55,0.91 51.46,1.83 51.46,5.18 53.19,6.91 C3.1 | 32.77,42.88 32.77,46.43 33.08,46.74 U$1.21 | 32.77,42.88 C19.1 | C22.1 42.83,41.76 45.16,41.76 C20.1 | C21.1 37.85,41.66 38.76,41.66 42.02,38.41 U1.22 | 32.77,42.88 27.59,42.88 26.47,41.76 25.56,41.76 C18.1 | C24.1 11.94,64.11 11.94,64.62 9.4,67.16 BUTTON1.P$1 | OK1.5 46.59,57.2 48.31,57.2 49.84,58.73 55.02,58.73 59.8,53.95 59.8,51.61 60.2,51.21 POWER.7 | 66.81,49 66.81,47.04 C12.1 | 62.74,49 62.74,51 POWER.6 | BUTTON3.P$4 108.06,48.26 108.06,58.22 BUTTON3.P$3 108.06,58.42 106.84,59.64 106.84,61.16 C16.1 106.63,61.27 106.33,61.27 100.54,67.06 BUTTON4.P$2 | 98,64.72 100.44,67.16 BUTTON4.P$2 | 98,64.72 97.79,64.52 97.79,63.81 C15.1 | BUTTON4.P$1 100.44,77.32 100.44,67.26 BUTTON4.P$2 | 98,64.72 93.02,69.7 J1.PWR 92.82,69.7 88.04,69.7 86.72,71.02 81.03,71.02 U$7.2
  Top 0.305: v72.7,46.43 71.58,47.55 71.58,49
  Top 0.406: 60.75,49 62.74,49 66.81,49 71.58,49 92.75,49 v93.25,49.5 87.55,55.2 R13.A 87.55,58.95 86.25,60.25 71.62,60.25 OK2.5 | 60.75,49 60.22,49.53 POWER.7 | 60.75,49 61.1,48.65 U$1.32 | XIO.35 10.24,46.75 v18.75,46.75 U$1.17
  Bottom 0.305: 27.39,5.08 38.87,5.08 39.98,6.2 SW2.E | 27.39,5.08 v26.37,5.08 | v25.15,18.59 21.49,18.59 19.36,20.73 19.05,20.73 SW1.C | 27.39,5.08 v27.39,7.21 | IC1.1 81.94,31.09 81.94,34.65 IC3.8 | v60.3,36.68 61.42,36.68 66.6,41.86 66.6,42.27 IC3.15 66.7,41.76 67.52,41.76 68.84,40.44 69.55,40.44 70.56,41.45 70.56,44.3 v72.7,46.43 | 82.96,18.59 87.33,18.59 89.46,20.73 SW4.C | 82.96,18.59 78.8,18.59 C2.1 | 84.08,25.4 83.06,24.38 83.06,22.05 82.96,21.95 82.96,18.59 | 84.08,25.4 84.99,26.31 85.4,26.31 IC2.15 | C11.1 97.69,36.17 96.68,36.17 95.36,34.85 95.36,26.11 97.69,23.77 C14.1 | SW3.C 65.99,20.73 65.69,20.73 64.47,19.51 59.59,19.51 55.94,23.16 54.92,23.16 U1.16 54.72,23.27 53.5,24.49 44.15,24.49 43.34,23.67 43.34,22.66 42.52,21.84 42.52,20.83 SW2.C 42.52,20.62 42.52,13.72 49.23,7.01 53.09,7.01 C3.1 53.29,6.91 54.31,6.91 55.33,5.89 63.15,5.89 63.45,6.2 SW3.E | 84.08,25.4 v80.72,28.75 | C4.1 18.34,41.76 18.34,46.33 18.65,46.63 v18.75,46.75 | C18.1 25.45,41.76 23.42,41.76 C17.1 | C22.1 42.73,41.66 42.73,39.12 42.12,38.51 U1.22 | C19.1 32.77,41.66 33.79,41.66 34.8,40.64 36.73,40.64 37.75,41.66 C21.1 | 5.62,61.57 5.44,61.57 3,61.57 C23.1 2.9,61.37 1.78,60.25 1.78,58.42 BUTTON2.P$1 | BUTTON2.P$2 1.78,48.16 5.54,48.16 5.74,48.16 | 39.58,80.75 39.58,76.71 40.19,76.1 40.19,71.12 U$9.2 | BUTTON1.P$1 9.3,67.16 5.74,67.16 5.57,67.16 | JP1.3 18.75,57.71 18.34,57.71 12.04,64.01 C24.1
  Bottom 0.406: J1.PWR 93.25,69.41 v93.25,49.5 93.25,41.83 IC2.8 | U$1.17 23.27,46.48 C17.1 | XIO.36 5.75,46.81 5.74,48.16 5.62,61.57 5.57,67.16 5.5,75 9.25,75 | 9.25,75 18.25,75 | 18.25,75 19.5,75 22.5,78 U$1.1 | BUTTON1.P$2 9.5,77.14 9.5,76.75 9.25,76.5 9.25,75 | 18.25,75 18.25,80.75 33.25,80.75 | 33.25,80.75 33.16,80.66 U$1.5 | 33.25,80.75 39.58,80.75 61.25,80.75 | 61.25,80.75 61.1,80.6 U$1.16 | 61.25,80.75 67.75,80.75 72.25,76.25 81,76.25 U$7.2 | 19,57.5 19,57.54 JP1.3 18.93,46.93 v18.75,46.75
INS0  (via drill 0.51)
  Top 0.203: v96.27,29.26 94.85,27.84 84.38,27.84 84.28,27.94 v83.67,27.94 46.59,27.94 42.32,32.21 27.89,32.21 v26.17,33.93 | v25.56,35.56 25.56,35.15 24.34,33.93 24.34,24.89 25.56,23.67 25.56,22.66 23.73,20.83 21.59,20.83 SW1.A
  Bottom 0.203: v83.67,27.94 83.67,34.44 85.4,36.17 85.4,36.47 IC2.11 | v96.27,29.26 97.39,30.38 100.74,30.38 101.96,29.16 R2.P$3 | C18.2 28,41.66 28,41.25 25.56,38.81 v25.56,35.56 26.17,34.95 v26.17,33.93
INS1  (via drill 0.51)
  Top 0.203: v90.99,38 87.02,34.04 85.5,34.04 IC2.12 | v99.52,38.71 99.52,37.19 100.84,35.87 100.84,35.46 | 100.84,35.46 100.84,32.82 101.96,31.7 R2.P$4 | v25.56,31.39 v31.65,31.39 | 100.84,35.46 105.72,35.46 107.04,36.78 107.04,40.64 107.24,40.84 107.24,44.6 87.63,64.21 77.88,64.21 76.97,63.3 60,63.3 59.08,64.21 v52.58,64.21
  Bottom 0.203: v90.99,38 95.25,38 97.29,40.03 98.2,40.03 v99.52,38.71 | 37.29,39.78 38.16,38.91 38.16,37.9 v31.65,31.39 | 37.29,39.78 37.04,40.03 32.97,40.03 31.35,41.66 30.23,41.66 C19.2 | v25.56,31.39 13.36,31.39 11.64,29.67 11.64,25.6 16.41,20.83 SW1.B | v52.58,64.21 52.58,58.32 46.08,51.82 46.08,49.38 44.45,47.75 44.45,45.41 41.81,42.77 39.78,42.77 38.87,41.86 38.87,41.35 37.29,39.78
INS2  (via drill 0.51)
  Top 0.203: v96.88,35.05 91.9,35.05 88.34,31.5 85.5,31.5 IC2.13 | SW2.A 44.96,20.73 43.84,19.61 39.07,19.61 37.14,21.54 31.86,21.54 30.74,22.66 30.74,23.57 24.74,29.57 24.74,33.73 25.76,34.75 30.23,34.75 32.26,36.78 34.5,36.78 35.62,37.9 35.62,38.91 35.31,39.22 35.31,41.66 C21.2 35.41,41.66 35.62,41.66 39.37,45.41 39.37,47.75 41,49.38 41,51.82 42.02,52.83 45.37,52.83 45.47,52.73 46.99,52.73 47.6,53.34 47.6,55.78 49.74,57.91 50.55,57.91 50.65,57.81 v54.61,57.81 | v62.44,60.86 90.38,60.86 106.84,44.4 106.84,41.05 106.63,40.84 106.63,38.91 105.72,38 104.91,38 103.69,36.78 102.06,36.78 R2.P$6
  Bottom 0.203: v96.88,35.05 100.33,35.05 101.96,36.68 R2.P$6 | v62.44,60.86 57.66,60.86 v54.61,57.81
INS3  (via drill 0.51)
  Top 0.203: 97.03,38.25 96.68,38.61 96.68,39.42 97.29,40.03 101.25,40.03 101.96,39.32 R2.P$7 | 97.03,38.25 97.39,37.9 97.59,37.9 98.81,36.68 98.81,33.33 98.1,32.61 97.79,32.61 95.56,30.38 92.31,30.38 90.89,28.96 85.5,28.96 IC2.14 | v40.7,25.4 40.7,23.77 40.8,23.67 40.8,21.54 40.09,20.83 SW2.B | 97.03,38.25 94.24,35.46 89.06,35.46 86.52,32.92 71.28,32.92 70.26,33.93 70.26,35.87 65.59,40.54 v52.99,40.54 | v52.58,36.07 50.35,36.07 v49.13,34.85
  Bottom 0.203: 48.52,34.24 43.13,34.24 41,36.37 41,37.59 40.8,37.8 40.8,38.91 40.29,39.42 40.29,41.66 C22.2 | 48.52,34.24 48.92,33.83 48.92,33.02 41.3,25.4 v40.7,25.4 | v52.99,40.54 52.58,40.54 50.96,38.91 50.96,37.69 v52.58,36.07 | 48.52,34.24 v49.13,34.85
INS4  (via drill 0.51)
  Top 0.203: 99.22,30.38 103.99,30.38 105.21,29.16 R1.P$3 | 99.22,30.38 98.81,30.38 | 98.81,30.38 96.17,30.38 94.75,28.96 93.12,28.96 IC2.3 | 99.22,30.38 99.22,36.88 97.79,38.3 97.79,38.91 C10.2 | v67.52,16.66 79.61,16.66 85.3,22.35 88.04,22.35 90.58,24.89 97.39,24.89 98.81,26.31 98.81,30.38
  Bottom 0.203: v67.52,16.66 68.43,17.58 68.43,20.73 SW3.A
INS5  (via drill 0.51)
  Top 0.203: C11.2 97.69,33.63 95.56,31.5 93.12,31.5 IC2.4 93.02,31.39 92.71,31.39 91.7,30.38 84.69,30.38 83.57,29.26 v82.86,29.26 | v72.8,25.81 66.91,25.81 65.59,24.49 65.59,22.66 63.76,20.83 63.55,20.83 SW3.B
  Bottom 0.203: v72.8,25.81 72.8,27.33 75.75,30.28 75.75,32.11 76.46,32.82 79.81,32.82 80.83,31.8 80.83,29.97 81.54,29.26 v82.86,29.26 | R1.P$4 105.21,31.7 103.58,31.7 102.37,32.92 99.42,32.92 98.71,33.63 97.79,33.63 C11.2
INS6  (via drill 0.51)
  Top 0.203: C13.2 97.69,4.78 97.69,6.2 92,11.89 92,20.73 SW4.A | v96.27,33.43 93.63,33.43 93.12,33.93 IC2.5
  Bottom 0.203: IC2.5 93.02,33.93 93.02,33.63 91.29,31.9 91.29,21.44 91.9,20.83 SW4.A | v96.27,33.43 97.08,32.61 99.11,32.61 101.35,30.38 105.72,30.38 106.43,31.09 106.43,32.11 105.72,32.82 104.91,32.82 104.09,33.63 104.09,34.65 105.21,35.76 105.21,36.68 R1.P$6
INS7
  Bottom 0.203: 94.85,21.13 94.44,21.13 92.92,19.61 91.09,19.61 90.68,20.02 90.68,21.64 90.38,21.95 88.14,21.95 87.02,20.83 SW4.B | 94.85,21.13 97.69,21.13 C14.2 | 94.85,36.58 96.37,36.58 97.69,37.9 103.89,37.9 105.21,39.22 R1.P$7 | 94.85,36.58 93.12,36.58 IC2.6 | 94.85,36.58 94.85,21.13
INS8  (via drill 0.51)
  Top 0.203: v82.35,47.14 83.57,47.14 84.89,48.46 v98.2,48.46 | R2.P$2 102.06,26.62 103.18,27.74 105.62,27.74 107.85,29.97 v107.85,36.78 107.85,46.43 87.53,66.75 87.53,69.29 86.62,70.21 82.96,70.21 81.54,68.78 77.88,68.78 71.28,75.39 35.82,75.39 34.29,76.91 34.29,79.35 33.68,79.96 25.05,79.96 24.13,79.05 24.13,76.71 21.7,74.27 v21.39,74.27 | v5.24,39.52 9.81,39.52 13.06,42.77 18.75,42.77 19.77,41.76 20.68,41.76 C17.2
  Bottom 0.203: v82.35,47.14 81.94,47.14 77.17,42.37 76.86,42.37 IC3.11 | v98.2,48.46 99.93,46.74 101.25,46.74 104.09,43.89 104.09,43.79 104.91,42.98 105.72,42.98 107.85,40.84 v107.85,36.78 | v5.24,39.52 5.24,12.9 6.56,11.58 10.11,11.58 10.93,10.77 19.77,10.77 20.17,11.18 20.98,11.18 21.49,10.67 21.49,6.3 SW1.D | v21.39,74.27 21.39,59.23 20.27,58.12 20.27,42.16 20.68,41.76 C17.2
INS9  (via drill 0.51)
  Top 0.203: v65.59,48.06 61.52,43.99 52.18,43.99 49.94,41.76 47.81,41.76 C20.2 | v74.12,46.43 v72.5,48.06
  Bottom 0.203: v72.5,48.06 v65.59,48.06 | IC3.12 74.22,42.37 74.12,42.47 v74.12,46.43 80.42,46.43 81.94,47.95 89.67,47.95 91.29,46.33 91.29,41.25 92.1,40.44 105.72,40.44 106.43,39.73 106.43,38.51 105.77,37.85 | 105.77,37.85 105.72,37.9 104.8,37.9 103.18,36.27 103.18,35.36 102.06,34.24 R2.P$5 | 105.77,37.85 106.43,37.19 106.43,36.98 107.24,36.17 107.24,19.41 88.75,0.91 49.64,0.91 48.92,1.63 48.92,3.56 46.28,6.2 45.06,6.2 SW2.D
INS10  (via drill 0.51)
  Top 0.203: v80.93,39.73 80.32,40.34 74.02,40.34 72.09,42.27 71.78,42.27 IC3.13 | v84.28,20.12 84.28,18.59 84.23,18.54 | 84.23,18.54 78.69,13.01 78.69,7.11 C9.2 | v88.55,18.49 84.28,18.49 84.23,18.54
  Bottom 0.203: v80.93,39.73 82.15,39.73 83.67,41.25 83.67,42.67 87.43,46.43 88.04,46.43 88.85,45.62 88.85,24.69 v84.28,20.12 | SW3.D 68.53,6.2 75.54,6.2 75.75,5.99 77.58,5.99 78.59,7.01 C9.2 | v88.55,18.49 98.61,18.49 103.18,23.06 103.18,24.08 105.21,26.11 105.21,26.52 R1.P$2
INS11  (via drill 0.51)
  Top 0.203: v71.38,46.43 69.85,46.43 69.35,46.94 C12.2 | v70.46,36.88 69.24,38.1 69.24,42.27 IC3.14 | v50.14,25.4 48.52,23.77 48.52,22.76 49.64,21.64 52.28,21.64 55.53,18.39 55.53,13.21 57.97,10.77 62.95,10.77 63.96,11.79 65.28,11.79 v67.11,9.96
  Bottom 0.203: v71.38,46.43 69.24,44.3 69.24,42.37 IC3.14 | R1.P$5 105.31,34.14 106.84,32.61 106.84,20.02 93.12,6.3 92,6.3 SW4.D 91.9,6.3 88.24,9.96 v67.11,9.96 | v70.46,36.88 70.46,30.07 67.21,26.82 51.57,26.82 v50.14,25.4
INS12  (via drill 0.51)
  Top 0.203: C23.2 2.9,64.11 2.9,66.04 1.78,67.16 BUTTON1.P$3 1.68,67.26 1.68,77.32 BUTTON1.P$4 | v41.3,43.79 41.3,41.76 42.42,40.64 46.69,40.64 48.31,39.01 48.31,38.1 49.13,37.29 50.14,37.29 50.85,38 50.85,38.81 51.77,39.73 63.86,39.73 68.84,34.75 69.14,34.75 IC3.3 | v37.04,76.2 37.04,79.15 v33.89,82.3
  Bottom 0.203: v41.3,43.79 39.37,45.72 39.37,49.28 38.46,50.19 38.46,52.73 37.44,53.75 37.44,75.79 v37.04,76.2 | BUTTON1.P$4 1.78,77.42 4.22,77.42 5.64,78.84 5.64,80.97 7.17,82.5 8.59,82.5 8.79,82.3 v33.89,82.3 91.29,82.3 99.32,74.27 99.32,71.12 96.27,68.07 96.27,46.23 100.64,41.86 101.96,41.86 R2.P$8
INS13  (via drill 0.51)
  Top 0.203: v78.29,39.52 78.29,38.61 76.36,36.68 74.02,36.68 72.09,34.75 71.78,34.75 IC3.4 | v86.31,47.14 88.04,47.14 88.85,46.33 v97.39,46.33 | v10.93,67.67 21.8,78.54 21.8,79.25 25.66,83.11 82.45,83.11 97.08,68.48 v97.08,66.95
  Bottom 0.203: BUTTON2.P$4 9.3,48.26 9.3,58.32 BUTTON2.P$3 9.4,58.42 11.94,60.96 11.94,61.47 C24.2 11.94,61.57 11.94,62.59 10.93,63.6 v10.93,67.67 | v78.29,39.52 78.8,39.52 80.83,41.55 80.83,44.4 83.67,47.24 86.21,47.24 v86.31,47.14 | R2.P$9 101.96,44.4 100.03,46.33 v97.39,46.33 96.68,47.04 96.68,64.21 97.08,64.62 v97.08,66.95
INS14  (via drill 0.51)
  Top 0.203: C15.2 97.79,61.16 100.54,58.42 BUTTON3.P$1 | v87.33,42.57 91.8,42.57 92.61,43.38 95.66,43.38 100.44,48.16 BUTTON3.P$2 100.23,47.85 103.18,44.91 103.18,44.7 105.21,42.67 105.21,41.86 R1.P$8
  Bottom 0.203: v87.33,42.57 87.33,41.35 86.52,40.54 84.69,40.54 82.45,38.3 75.54,38.3 74.32,37.08 74.32,34.75 IC3.5 | BUTTON3.P$1 100.44,58.32 100.44,48.26 BUTTON3.P$2
INS15
  Top 0.203: C16.2 106.84,63.81 106.84,65.94 108.06,67.16 BUTTON4.P$4 108.06,67.26 108.06,77.32 BUTTON4.P$3 | IC3.6 76.86,34.75 77.17,34.75 82.55,40.13 96.78,40.13 97.08,40.44 105.62,40.44 106.43,41.25 106.43,43.18 105.31,44.3 R1.P$9
  Bottom 0.203: C16.2 106.73,63.7 106.73,62.69 105.31,61.27 105.31,44.4 R1.P$9
N$1
  Top 0.203: R8.1 35.92,64.62 35.92,67.97 35.21,68.68 U$9.5
N$3
  Bottom 0.203: R4.2 26.88,19.3 26.88,21.44 25.56,22.76 25.56,23.67 22.81,26.42 15.6,26.42 LED0.A
N$4  (via drill 0.51)
  Top 0.203: v43.44,17.78 38.16,17.78 34.8,21.13 31.45,21.13 29.42,23.16 U1.6
  Bottom 0.203: v43.44,17.78 65.08,17.78 67.11,19.81 67.11,21.44 67.72,22.05 67.72,24.59 67.11,25.2 66.3,25.2 64.57,23.47 64.16,23.47 IC1.13
N$5  (via drill 0.51)
  Top 0.203: v63.76,18.59 72.9,18.59 73.92,19.61 76.46,19.61 79.3,22.45 79.3,23.37 IC1.19
  Bottom 0.203: v63.76,18.59 59.19,18.59 58.78,18.19 49.64,18.19 44.66,23.16 U1.12
N$6  (via drill 0.51)
  Top 0.203: v45.47,26.62 73.31,26.62 76.46,23.47 76.76,23.47 IC1.18
  Bottom 0.203: v45.47,26.62 42.12,23.27 U1.11
N$7  (via drill 0.51)
  Top 0.203: v75.34,20.83 72.19,20.83 70.67,22.35 70.67,24.49 71.38,25.2 72.19,25.2 73.92,23.47 74.22,23.47 IC1.17 | v74.93,15.75 67.21,15.75 v65.48,14.02 | v43.44,14.12 42.62,14.12 v41.61,15.14
  Bottom 0.203: v75.34,20.83 77.27,18.9 77.27,18.09 v74.93,15.75 | v65.48,14.02 62.64,11.18 62.64,11.07 62.34,10.77 46.18,10.77 43.44,13.51 v43.44,14.12 | v41.61,15.14 41.61,19.51 41.2,19.91 41.2,21.64 39.58,23.27 U1.10
N$8
  Top 0.203: IC1.16 71.78,23.37 72.19,23.37 73.92,21.64 77.27,21.64 77.88,22.25 77.88,24.59 75.34,27.13 46.18,27.13 45.06,28.25 39.88,28.25 37.04,25.4 37.04,23.27 U1.9
N$9  (via drill 0.51)
  Top 0.203: v50.24,16.97 50.24,17.58 46.59,21.23 46.59,22.15 45.88,22.86 45.88,23.67 41.71,27.84 40.09,27.84 38.26,26.01 38.26,22.76 37.44,21.95 35.72,21.95 34.5,23.16 U1.8
  Bottom 0.203: v50.24,16.97 56.95,16.97 58.07,15.85 67.92,15.85 69.65,17.58 69.65,21.64 69.24,22.05 69.24,23.37 IC1.15
N$10
  Top 0.203: IC1.14 66.7,23.37 66.7,22.15 67.31,21.54 67.31,19.81 67.52,19.61 73.31,19.61 73.72,20.02 76.25,20.02 78.29,22.05 78.29,24.79 75.54,27.53 46.38,27.53 45.27,28.65 37.34,28.65 31.96,23.27 U1.7
N$11  (via drill 0.51)
  Top 0.203: v56.75,15.95 56.75,19.2 57.87,20.32 58.17,20.32 61.22,23.37 61.52,23.37 IC1.12 | v43.44,15.95 39.37,15.95 34.6,20.73 29.21,20.73 26.88,23.06 U1.5
  Bottom 0.203: v43.44,15.95 v56.75,15.95
N$12
  Top 0.203: IC3.10 79.4,42.27 79.71,42.27 81.44,40.54 84.38,40.54 85.4,41.55 IC2.9
N$13
  Top 0.203: R3.2 58.37,19.2 61.93,19.2 63.66,17.48 79.81,17.48 85.09,22.76 87.84,22.76 90.38,25.3 96.27,25.3 97.69,26.72 LED1.A
N$14
  Top 0.203: 16.51,68.78 14.89,68.78 U$10.5 | 16.51,68.78 20.48,68.78 21.9,70.21 25.56,70.21 26.06,69.7 33.28,69.7 33.79,70.21 35.72,70.21 37.14,68.78 40.39,68.78 43.95,65.23 43.95,64.82 OK1.3 | 16.51,68.78 16.51,65.33 D1.A
N$15
  Top 0.203: R5.1 24.24,62.28 24.24,63.2 25.86,64.82 25.86,67.87 25.05,68.68 U$10.4
N$16
  Bottom 0.203: R7.1 49.13,61.57 49.13,63.7 47.6,65.23 47.6,66.65 45.57,68.68 45.37,68.68 U$9.4
N$17
  Top 0.203: R10.1 76.76,64.62 81.94,64.62 86.01,68.68 U$7.4
N$18
  Top 0.203: D2.C 57.15,65.43 58.88,65.43 60.61,63.7 62.44,63.7 63.45,64.72 OK2.2
  Bottom 0.203: R6.2 71.38,57.1 71.17,57.1 63.55,64.72 OK2.2
N$19
  Top 0.203: OK2.3 65.99,64.82 65.99,65.23 62.54,68.68 55.63,68.68 U$8.5 55.53,68.68 52.38,65.53 49.53,65.53 D2.A
N$20
  Top 0.254: 104,53.75 104,53.5
N$21
  Top 0.203: R6.1 71.38,64.72 71.38,64.92 67.62,68.68 65.79,68.68 U$8.4
N$22
  Top 0.203: R9.1 74.22,64.62 74.22,67.06 75.85,68.68 U$7.5
N$23  (via drill 0.6)
  Top 0.406: 95,44 v94.75,44.25 63,44.25 60.75,42 S1.3
  Bottom 0.406: v94.75,44.25 95.25,44.75 95.25,67 95.75,67.5 95.75,73.75 | 95.75,73.75 93.5,76 J1.GND@1 | 95.75,73.75 96.8,72.7 J1.GND@2
N$26
  Top 0.203: OK1.2 41.41,64.72 40.29,64.72 37.85,62.28 31.86,62.28 R5.2
  Bottom 0.203: R5.2 31.75,62.28 27.08,62.28 24.13,65.23 D1.C
N$27
  Top 0.203: R13.S 84.99,62.99 77.27,62.99 77.17,62.89 59.8,62.89 59.29,63.4 49.43,63.4 47.6,65.23 47.6,68.48 41.51,74.57 31.45,74.57 28.1,77.93 U$1.3
  Bottom 0.203: R13.S1 85.09,58.01 85.09,62.99 R13.S | U$1.19 28.1,46.84 28.1,52.32 32.87,57.1 32.87,63.6 28.91,67.56 28.91,77.11 28.1,77.93 U$1.3
PA0  (via drill 0.51)
  Top 0.203: v64.88,10.97 63.76,10.97 63.15,10.36 57.76,10.36 53.09,15.04 53.09,20.22 52.07,21.23 49.64,21.23 | 49.64,21.23 49.13,21.23 47.2,23.16 U1.13 | v43.44,6.81 45.77,9.14 50.14,9.14 51.06,10.06 51.06,17.37 49.64,18.8 49.64,21.23
  Bottom 0.203: v64.88,10.97 64.88,11.58 75.34,22.05 75.34,24.08 79.3,28.04 79.3,30.99 IC1.2 | v43.44,6.81 41.71,5.08 39.98,5.08 35.82,0.91 16.62,0.91 15.9,1.63 15.9,2.64 13.26,5.28 9.5,5.28 XIO.3
PA1  (via drill 0.51)
  Top 0.203: U1.14 49.74,23.27 52.48,26.01 54.61,26.01 55.02,25.6 v55.83,25.6 56.04,25.4 56.04,22.76 55.94,22.66 55.94,15.54 56.34,15.14 57.15,15.14 57.76,15.75 62.54,15.75 67.92,10.36 67.92,9.55 67.31,8.94 64.06,8.94 v59.39,4.27 | v24.74,7.42 15.6,7.42 14.79,6.6 9.1,6.6 7.88,5.38 6.96,5.38 XIO.4
  Bottom 0.203: v55.83,25.6 56.24,26.01 71.38,26.01 72.39,24.99 73.21,24.99 76.76,28.55 76.76,30.99 IC1.3 | v24.74,7.42 26.37,7.42 26.98,8.03 46.08,8.03 49.53,4.57 59.08,4.57 v59.39,4.27
PA2  (via drill 0.51)
  Top 0.203: v54.21,25.2 52.28,23.27 U1.15 | v49.74,9.96 39.78,9.96 33.68,3.86 33.68,1.93 32.67,0.91 11.94,0.91 10.82,2.03 10.82,3.05 9.91,3.96 6.56,3.96 5.64,4.88 5.64,5.69 6.46,6.5 7.27,6.5 8.59,7.82 9.4,7.82 XIO.5 | v52.28,19.81 v52.28,9.96
  Bottom 0.203: v54.21,25.2 55.43,26.42 69.35,26.42 73.92,30.99 74.22,30.99 IC1.4 | v52.28,9.96 v49.74,9.96 | v52.28,19.81 52.28,23.16 U1.15
PA3  (via drill 0.51)
  Top 0.203: IC1.5 71.68,31.09 71.38,31.09 69.55,32.92 66.2,32.92 65.18,33.93 65.18,35.87 62.64,38.41 54.82,38.41 U1.17 | v20.98,78.94 17.84,78.94 5.54,66.65 5.54,60.15 0.56,55.17 0.56,15.04 6.86,8.74 6.86,7.93 XIO.6 | v33.28,75.39 35.21,75.39 35.62,74.98 61.52,74.98 v65.89,70.61
  Bottom 0.203: v20.98,78.94 21.49,78.94 22.51,79.96 31.14,79.96 31.96,79.15 31.96,76.71 v33.28,75.39 | v65.89,70.61 70.36,66.14 70.36,64.21 76.56,58.01 77.17,58.01 77.78,57.4 77.78,55.58 74.02,51.82 74.02,48.36 72.9,47.24 70.97,47.24 67.82,44.09 66.2,44.09 65.18,43.08 65.18,41.15 62.54,38.51 54.82,38.51 U1.17
PA4  (via drill 0.51)
  Top 0.203: v54.61,36.07 v54.61,33.02 50.35,33.02 49.94,33.43 v48.11,33.43 | v26.47,10.36 v20.58,10.36
  Bottom 0.203: v54.61,33.02 59.39,28.25 66.7,28.25 69.14,30.68 69.14,30.99 IC1.6 | v54.61,36.07 52.28,38.41 U1.18 | v20.58,10.36 9.5,10.36 XIO.7 | v26.47,10.36 26.67,10.36 33.48,17.17 33.48,20.52 35.82,22.86 35.82,23.67 38.36,26.21 40.9,26.21 v48.11,33.43
PA5  (via drill 0.51)
  Top 0.203: v8.79,68.68 5.95,65.84 5.95,50.39 1.38,45.82 1.38,16.76 6.86,11.28 6.86,10.46 XIO.8 | v20.58,63.4 20.98,63.4 23.93,60.45 v39.37,60.45 | v43.54,49.17 43.54,48.97 44.66,47.85 44.66,43.79 46.69,41.76 46.69,41.35 49.64,38.41 U1.19
  Bottom 0.203: IC1.7 66.6,31.09 66.3,31.09 64.47,32.92 62.54,32.92 61.02,34.44 52.99,34.44 49.74,37.69 49.74,38.41 U1.19 | v8.79,68.68 12.86,68.68 15.19,66.34 17.63,66.34 v20.58,63.4 | v39.37,60.45 39.37,58.22 40.39,57.2 40.39,55.27 43.54,52.12 v43.54,49.17
PA6  (via drill 0.51)
  Top 0.203: v50.75,33.83 48.92,33.83 46.28,36.47 44.86,36.47 43.79,37.54 | 43.79,37.54 43.34,38 43.34,38.91 44.15,39.73 45.88,39.73 47.1,38.51 U1.20 | v26.27,16.15 11.33,16.15 10.72,15.54 10.72,15.04 9.5,13.82 9.5,13.01 XIO.9 | 43.79,37.54 v39.68,33.43
  Bottom 0.203: v50.75,33.83 61.02,33.83 63.76,31.09 64.06,31.09 IC1.8 | v26.27,16.15 26.57,16.15 33.28,22.86 33.28,27.03 v39.68,33.43
PA7  (via drill 0.51)
  Top 0.203: IC1.9 61.62,31.09 61.62,34.34 62.34,35.05 62.34,35.97 60.81,37.49 55.43,37.49 54.82,36.88 46.18,36.88 44.66,38.41 U1.21 | v25.35,16.97 v14.58,16.97 | v41.81,36.78 v39.68,34.65
  Bottom 0.203: v14.58,16.97 12.14,16.97 10.72,15.54 10.72,15.04 9.91,14.22 9.1,14.22 7.88,13.01 6.96,13.01 XIO.10 | v25.35,16.97 26.78,16.97 30.74,20.93 30.74,25.7 v39.68,34.65 | v41.81,36.78 42.93,36.78 44.56,38.41 U1.21
PB0  (via drill 0.51)
  Top 0.203: v8.49,49.68 19.16,49.68 25.86,56.39 27.79,56.39 29.01,57.61 JP1.7
  Bottom 0.203: v8.49,49.68 8.18,49.38 8.18,45.52 6.96,44.3 6.96,43.48 XIO.34
PB1
  Top 0.203: XIO.33 9.4,43.48 9.4,44.3 8.08,45.62 8.08,48.87 7.67,49.28 7.67,50.09 13.97,56.39 20.17,56.39 21.39,57.61 JP1.4
PB2  (via drill 0.51)
  Top 0.203: v17.94,50.49 19.36,50.49 26.47,57.61 JP1.6
  Bottom 0.203: v17.94,50.49 14.69,47.24 14.69,40.13 11.64,37.08 6.46,37.08 5.64,37.9 5.64,38.71 6.86,39.93 6.86,40.84 XIO.32
PB3  (via drill 0.51)
  Top 0.203: v24.13,52.02 24.13,45.41 23.52,44.81 14.48,44.81 10.62,40.95 9.5,40.95 XIO.31
  Bottom 0.203: v24.13,52.02 24.13,57.51 24.03,57.61 JP1.5
PC0
  Top 0.203: XIO.18 6.86,23.16 6.86,23.98 5.64,25.2 5.64,33.63 6.56,34.54 7.37,34.54 8.18,35.36 8.18,36.17 9.1,37.08 9.91,37.08 10.82,38 10.82,38.81 12.04,40.03 27.79,40.03 29.32,38.51 U1.27
PC1
  Bottom 0.203: XIO.17 9.5,23.06 12.14,23.06 17.43,17.78 26.98,17.78 28.2,19 28.2,29.67 31.86,33.33 31.86,38.41 U1.26
PC2  (via drill 0.51)
  Top 0.203: v13.67,17.88 23.22,17.88 25.66,20.32 31.96,20.32 36.53,15.75 38.97,15.75 41.41,13.31 43.84,13.31 45.88,15.34 45.88,19.51 46.18,19.81 46.18,21.64 45.77,22.05 44.15,22.05 43.34,22.86 43.34,24.18 v40.49,27.03
  Bottom 0.203: v13.67,17.88 12.35,19.2 9.1,19.2 7.78,20.52 6.96,20.52 XIO.16 | v40.49,27.03 40.49,37.49 39.58,38.41 U1.23
PC3  (via drill 0.51)
  Top 0.203: v17.94,27.23 11.33,20.62 9.5,20.62 XIO.15 | v29.82,33.73 32.06,35.97 v32.67,35.97
  Bottom 0.203: v17.94,27.23 23.32,27.23 v29.82,33.73 | v32.67,35.97 32.67,36.68 34.4,38.41 U1.25
PC4  (via drill 0.51)
  Top 0.203: v18.24,24.38 15.7,24.38 10.62,19.3 9.1,19.3 7.88,18.09 6.96,18.09 XIO.14
  Bottom 0.203: v18.24,24.38 23.02,24.38 24.24,23.16 U1.4
PC5
  Top 0.203: XIO.13 9.5,18.09 11.43,18.09 15.29,21.95 19.77,21.95 20.48,22.66 20.48,35.36 17.94,37.9 17.94,38.81 18.75,39.62 25.56,39.62 26.78,38.41 U1.28
PC6
  Top 0.203: XIO.12 6.96,15.54 7.88,15.54 9.1,16.76 10.72,16.76 13.57,19.61 19.97,19.61 20.38,20.02 20.38,21.74 21.7,23.06 U1.3
PC7  (via drill 0.51)
  Top 0.203: v23.02,20.02 22.2,19.2 13.77,19.2 10.11,15.54 9.5,15.54 XIO.11 | v23.02,22.15 23.02,34.44 19.16,38.3 U1.31
  Bottom 0.203: v23.02,22.15 v23.02,20.02
PE4
  Top 0.203: R3.1 50.75,19.2 50.75,18.29 51.46,17.58 51.46,9.25 45.06,2.85 PWML.3
PE5  (via drill 0.51)
  Top 0.203: v49.84,6.1 49.84,5.08 47.6,2.85 PWML.4
  Bottom 0.203: v49.84,6.1 49.43,6.1 45.57,9.96 29.72,9.96 29.01,10.67 29.01,11.48 34.5,16.97 34.5,19.2 R4.1
PG0
  Bottom 0.203: XIO.22 6.96,28.25 7.88,28.25 9.1,29.46 10.11,29.46 16.11,35.46 22.61,35.46 24.24,37.08 24.24,38.3 U1.29
PG1
  Bottom 0.203: XIO.21 9.5,28.25 14.38,33.12 26.57,33.12 28.1,34.65 28.1,38.91 28.81,39.62 35.82,39.62 36.94,38.51 U1.24
PG2
  Bottom 0.203: IC1.11 59.08,23.47 59.49,23.47 61.62,25.6 69.24,25.6 70.26,24.59 70.26,17.58 64.06,11.38 64.06,7.82 64.67,7.21 64.67,5.28 64.47,5.08 49.64,5.08 45.16,9.55 23.22,9.55 10.93,21.84 9,21.84 8.08,22.76 8.08,24.49 6.96,25.6 XIO.20
PL0  (via drill 0.51)
  Top 0.203: v84.08,46.43 82.86,46.43 82.76,46.33 81.94,46.33 v80.22,48.06 | v40.39,58.42 40.39,53.75 39.37,52.73 37.85,52.73 37.75,52.83 22.91,52.83 17.84,47.75 v10.82,47.75
  Bottom 0.203: v84.08,46.43 81.94,44.3 81.94,42.37 IC3.9 | v80.22,48.06 80.22,57.1 72.5,64.82 72.5,65.02 67.82,69.7 67.72,69.7 66.7,70.71 66.7,71.02 61.73,76 60.61,76 59.69,76.91 59.69,79.35 59.08,79.96 47.91,79.96 46.99,79.05 46.99,73.25 40.39,66.65 v40.39,58.42 | v10.82,47.75 10.82,43.08 9.81,42.06 9,42.06 8.08,41.15 8.08,39.52 6.96,38.41 XIO.30
PL1  (via drill 0.51)
  Top 0.203: v85.5,19.71 85.5,21.34 86.11,21.95 88.24,21.95 90.07,23.77 93.02,23.77 IC2.1 | v75.95,37.49 71.07,37.49 v70.06,38.51 | v30.54,36.88 30.54,38.91 29.01,40.44 11.84,40.44 9.81,38.41 9.5,38.41 XIO.29 | v31.04,33.73 38.16,33.73 39.27,32.61 53.8,32.61 57.36,29.06 v59.8,29.06
  Bottom 0.203: v85.5,19.71 85.09,19.71 84.69,19.3 83.88,19.3 83.47,19.71 83.47,21.74 83.67,21.95 83.67,24.28 84.69,25.3 86.52,25.3 87.23,26.01 87.23,36.98 86.62,37.59 76.05,37.59 v75.95,37.49 | v70.06,38.51 67.92,38.51 64.16,34.75 IC3.1 64.27,34.75 66.09,32.92 67.01,32.92 67.72,32.21 67.72,29.87 66.91,29.06 v59.8,29.06 | v30.54,36.88 30.54,34.24 v31.04,33.73
PL2  (via drill 0.51)
  Top 0.203: v90.48,26.62 92.82,26.62 93.02,26.42 IC2.2 | v3,39.73 6.86,35.87 XIO.28 | v91.19,47.65 89.77,47.65 v89.26,47.14
  Bottom 0.203: 88.6,46.48 90.17,44.91 90.17,26.92 v90.48,26.62 | 88.6,46.48 88.24,46.84 87.23,46.84 83.27,42.88 83.27,41.45 82.35,40.54 80.52,40.54 78.69,38.71 75.34,38.71 74.32,37.69 69.96,37.69 67.01,34.75 66.7,34.75 IC3.2 | v3,39.73 3,44.91 0.56,47.35 0.56,70.81 8.28,78.54 15.29,78.54 18.04,81.28 76.76,81.28 84.59,73.46 84.59,65.94 91.19,59.33 v91.19,47.65 | 88.6,46.48 v89.26,47.14
PL3
  Bottom 0.203: XIO.27 9.5,35.87 22.41,35.87 22.91,36.37 22.91,38.71 23.83,39.62 24.84,39.62 26.57,41.35 26.57,41.76 30.54,45.72 30.54,46.74 U$1.20 30.64,46.84 33.28,49.48 33.28,63.81 30.64,66.45 30.64,77.93 U$1.4
PL4  (via drill 0.51)
  Top 0.203: v15.19,36.68 13.06,34.54 9.1,34.54 7.88,33.33 6.96,33.33 XIO.26 | v22,36.68 29.52,36.68 30.13,36.07 30.94,36.07 32.06,37.19 32.36,37.19 33.18,38 33.18,40.64 34.19,41.66 34.19,45.31 35.62,46.74 U$1.22
  Bottom 0.203: U$1.22 35.72,46.84 35.72,49.68 36.22,50.19 36.22,55.68 37.04,56.49 37.04,74.98 35.72,76.3 35.72,77.93 U$1.6 | v22,36.68 v15.19,36.68
PL6
  Top 0.203: XIO.24 6.96,30.68 7.78,30.68 9.1,29.36 11.13,29.36 12.45,28.04 18.34,28.04 19.16,27.23 19.16,23.16 U1.2
RXD1  (via drill 0.51)
  Top 0.203: R12.1 46.49,53.85 46.49,54.36 44.05,56.79 44.05,57.1 OK1.6 | v2.19,17.27 2.19,17.88 1.78,18.29 1.78,45.62 10.42,54.25 10.42,61.37 12.04,62.99 12.45,62.99 13.36,63.91 13.36,69.29 17.53,73.46 40.7,73.46 42.93,71.22 v42.93,67.46
  Bottom 0.203: v2.19,17.27 2.19,10.87 6.46,6.6 12.55,6.6 14.08,5.08 19.46,5.08 21.7,2.85 22.1,2.85 COMMUNICATION.3 | v42.93,67.46 42.93,58.22 43.95,57.2 OK1.6
RXD2
  Top 0.203: R11.1 68.43,53.85 68.43,54.46 66.09,56.79 66.09,57.1 OK2.6 65.99,57.2 64.98,58.22 63.86,58.22 59.49,62.59 40.29,62.59 38.87,61.16 23.83,61.16 23.12,61.87 23.12,62.08 20.98,64.21 20.17,64.21 16.41,60.45 11.43,60.45 10.82,59.84 10.82,54.05 2.19,45.41 2.19,18.49 6.46,14.22 7.27,14.22 8.08,13.41 8.08,12.6 9,11.68 9.81,11.68 11.94,9.55 23.83,9.55 27.18,6.2 27.18,2.85 COMMUNICATION.5
TXD1  (via drill 0.51)
  Top 0.203: v17.94,51.71 19.87,51.71 25.25,57.1 25.25,58.01 26.06,58.83 32.16,58.83 33.99,57 35.92,57 R8.2 | v12.76,45.01 9.81,42.06 6.46,42.06 v5.13,40.74
  Bottom 0.203: v17.94,51.71 12.76,46.53 v12.76,45.01 | v5.13,40.74 4.42,40.03 4.42,11.18 6.56,9.04 16.62,9.04 21.09,4.57 22.91,4.57 24.64,2.85 COMMUNICATION.4
TXD2  (via drill 0.51)
  Top 0.203: v29.82,11.07 29.82,2.85 COMMUNICATION.6
  Bottom 0.203: v29.82,11.07 38.26,19.51 38.26,23.57 39.07,24.38 40.9,24.38 49.94,33.43 49.94,35.26 48.42,36.78 48.42,40.23 52.07,43.89 52.07,47.75 53.7,49.38 53.7,51.41 60.51,58.22 69.04,58.22 69.65,57.61 69.65,57.3 70.97,55.98 71.89,55.98 72.8,56.9 74.12,56.9 R9.2
VIN
  Bottom 0.406: POWER.8 54.75,51.01 S1.2

### Text on the board
tPlace: DB5 | DB7 | K | JP-LCD | GND | +5V | V0 | RS | R/W | E | DB4 | DB6 | A | BUTTON1 | BUTTON4 | 3FTH9 | 3FTH9 | BUTTON2 | VIN | BUTTON3 | LCD | 3FTH9 | HD44780 | 3FTH9 | GND | +5V | V0 | RS | RS | R/W | E | GND | GND | 5V | ADC3 | ADC2 | ADC2 | ADC1 | GND | GND | JP-LCD | DB4 | DB5 | DB6 | DB7 | A | K | PB0 | PB1 | PWR SW | PB2 | PB3 | DIGITAL | DIGITAL | PL0 | PL1 | PL2 | PL3 | PL4 | 128K x 8 | SRAM AS6C1008-55PCN | PL6 | PG0 | PG1 | PG2 | PC0 | PC1 | PC2 | PC3 | PC4 | PC5 | PC6 | PC7 | PA7 | PA6 | PA5 | PA4 | PA3 | PA2 | MEGACOMMAND 1.0.0c | PA1 | PA0 | PA0 | TXD1 | TXD2 | PE4 | PE5 | 5V | RXD1 | RXD2 | GND
bPlace: RXD1 | TXD1 | RXD2 | TXD2 | VIN | GND | Micro SD | 5V | 3V | GND | CLK | DO | DI | CS | CD